# Altium project zxevo.PrjPcb (part 2 of 2)

## Sheet Power ATX.SchDoc
size A4; SheetNumber: 2; SheetTotal: 15
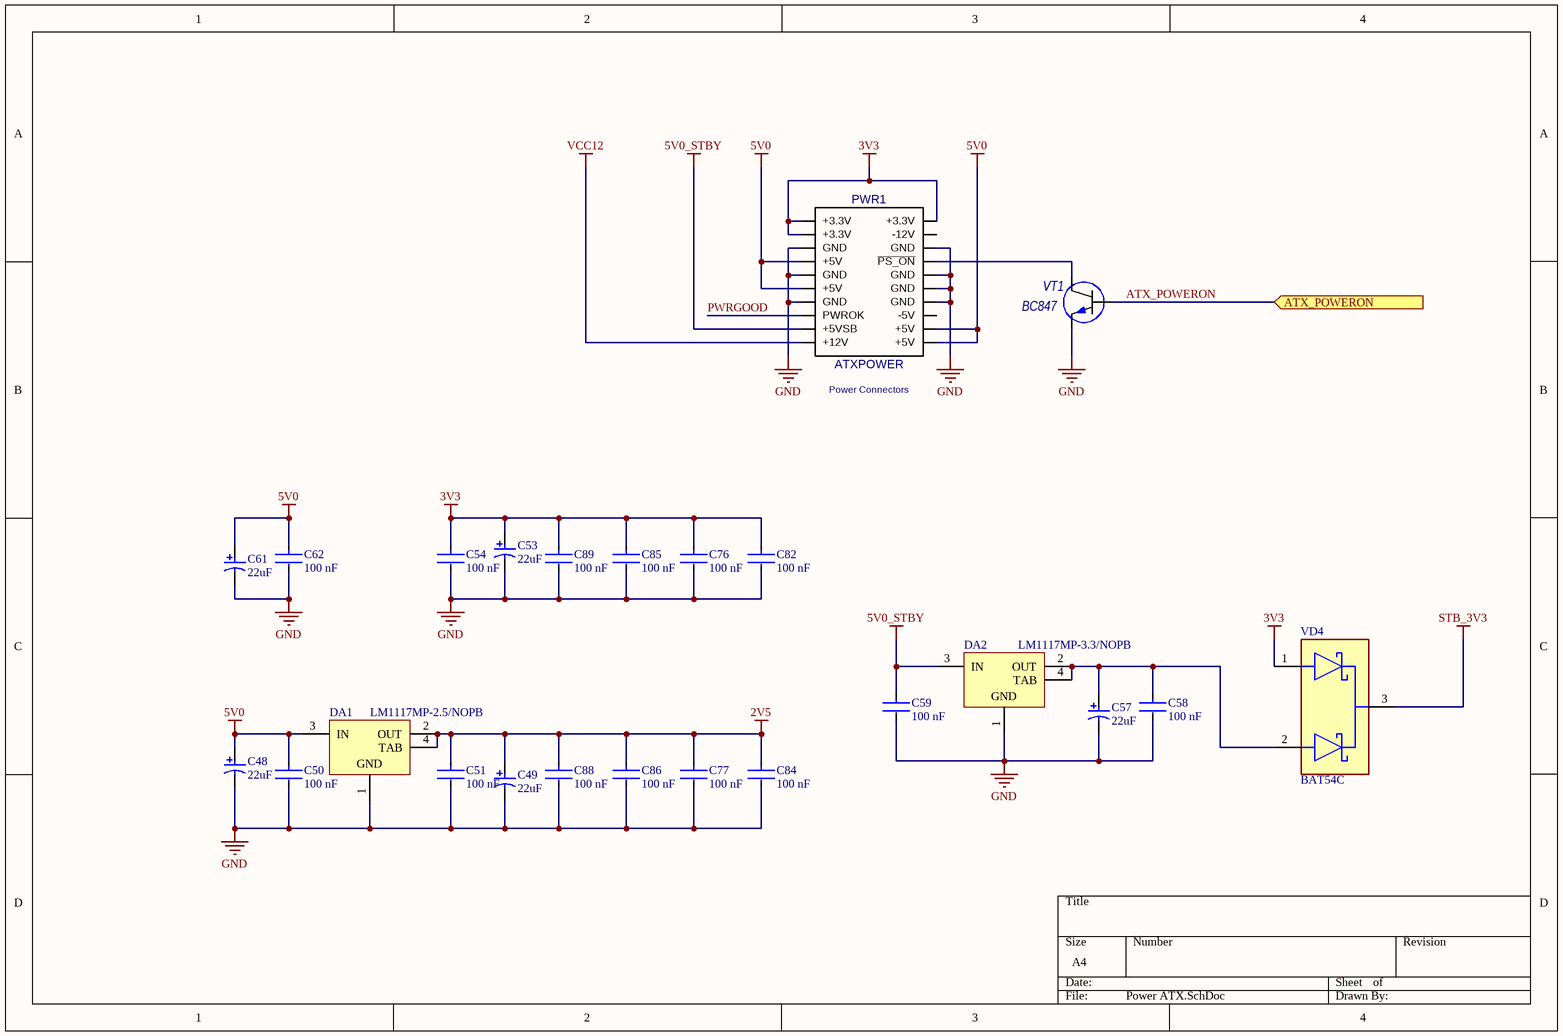
[diagram p9: Power ATX.SchDoc]

### Parts
C48  Capacitance: 22uF  [AVX-TAJ-B-2_M]  (hidden comment: TAJB226K016RNJ)
C49  Capacitance: 22uF  [AVX-TAJ-B-2_M]  (hidden comment: TAJB226K016RNJ)
C50  Capacitance: 100 nF  [FP-CC0805-0_85-IPC_A]  (hidden comment: CC0805KRX7R9BB104)
C51  Capacitance: 100 nF  [FP-CC0805-0_85-IPC_A]  (hidden comment: CC0805KRX7R9BB104)
C53  Capacitance: 22uF  [AVX-TAJ-B-2_M]  (hidden comment: TAJB226K016RNJ)
C54  Capacitance: 100 nF  [FP-CC0805-0_85-IPC_A]  (hidden comment: CC0805KRX7R9BB104)
C57  Capacitance: 22uF  [AVX-TAJ-B-2_M]  (hidden comment: TAJB226K016RNJ)
C58  Capacitance: 100 nF  [FP-CC0805-0_85-IPC_A]  (hidden comment: CC0805KRX7R9BB104)
C59  Capacitance: 100 nF  [FP-CC0805-0_85-IPC_A]  (hidden comment: CC0805KRX7R9BB104)
C61  Capacitance: 22uF  [AVX-TAJ-B-2_M]  (hidden comment: TAJB226K016RNJ)
C62  Capacitance: 100 nF  [FP-CC0805-0_85-IPC_A]  (hidden comment: CC0805KRX7R9BB104)
C76  Capacitance: 100 nF  [FP-CC0805-0_85-IPC_A]  (hidden comment: CC0805KRX7R9BB104)
C77  Capacitance: 100 nF  [FP-CC0805-0_85-IPC_A]  (hidden comment: CC0805KRX7R9BB104)
C82  Capacitance: 100 nF  [FP-CC0805-0_85-IPC_A]  (hidden comment: CC0805KRX7R9BB104)
C84  Capacitance: 100 nF  [FP-CC0805-0_85-IPC_A]  (hidden comment: CC0805KRX7R9BB104)
C85  Capacitance: 100 nF  [FP-CC0805-0_85-IPC_A]  (hidden comment: CC0805KRX7R9BB104)
C86  Capacitance: 100 nF  [FP-CC0805-0_85-IPC_A]  (hidden comment: CC0805KRX7R9BB104)
C88  Capacitance: 100 nF  [FP-CC0805-0_85-IPC_A]  (hidden comment: CC0805KRX7R9BB104)
C89  Capacitance: 100 nF  [FP-CC0805-0_85-IPC_A]  (hidden comment: CC0805KRX7R9BB104)
DA1  LM1117MP-2.5/NOPB  [DCY0004A_M]
DA2  LM1117MP-3.3/NOPB  [DCY0004A_L]
PWR1  ATXPOWER  [ATXPOWER]
VD4  BAT54C  [FP-MA03D-MFG]
VT1  BC847  [SOT-23]

### Ports
ATX_POWERON (in)

### Nets
2V5: C49.1 C51.1 C77.1 C84.1 C86.1 C88.1 DA1.2(OUT) DA1.4(TAB)
3V3: C53.1 C54.1 C76.1 C82.1 C85.1 C89.1 PWR1.1(+3.3V) PWR1.2(+3.3V) PWR1.11(+3.3V) VD4.1(1_ANODE)
5V0: C48.1 C50.1 C61.1 C62.1 DA1.3(IN) PWR1.4(+5V) PWR1.6(+5V) PWR1.19(+5V) PWR1.20(+5V)
5V0_STBY: C59.1 DA2.3(IN) PWR1.9(+5VSB)
GND: C48.2 C49.2 C50.2 C51.2 C53.2 C54.2 C57.2 C58.2 C59.2 C61.2 C62.2 C76.2 C77.2 C82.2 C84.2 C85.2 C86.2 C88.2 C89.2 DA1.1(GND) DA2.1(GND) PWR1.3(GND) PWR1.5(GND) PWR1.7(GND) PWR1.13(GND) PWR1.15(GND) PWR1.16(GND) PWR1.17(GND) VT1.2(emitter)
STB_3V3: VD4.3(COMMON_CATHODE)
VCC12: PWR1.10(+12V)
ATX_POWERON: VT1.1(base) ; port ATX_POWERON
PWRGOOD: PWR1.8(PWROK)  [project net PWRGOOD_2]
NetC57_1: C57.1 C58.1 DA2.2(OUT) DA2.4(TAB) VD4.2(2_ANODE)
NetPWR1_14: PWR1.14(~{PS_ON}) VT1.3(collector)

Not connected (* = marked no-connect by the designer): PWR1 12(-12V) 18(-5V)

### Notes on the sheet
- (near PWR1) Power Connectors

### Library data of the parts
C48 C49 C53 C57 C61 = CMP-2100-03689-1: Standard Tantalum, 22 uF, +/- 10%, 16 V, -55 to 125 degC, 2-Pin SMD (1210), RoHS, Tape and Reel; Manufacturer: Kyocera AVX; value: 22uF; Number of Pins: 2; Termination: SMD/SMT; Case/Package: 1210; Manufacturer Part Number: TAJB226K016RNJ; Category: Cap
C50 C51 C54 C58 C59 C62 C76 C77 C82 C84-C86 C88 C89 = CMP-2100-03606-3: as C106 on sheet FPGA; Manufacturer Part Number: CC0805KRX7R9BB104; Category: Cap; Case/Package: 0805
DA1 = CMP-0062-01660-4: 800mA Low-Dropout Linear Regulator, 4-pin SOT-223, Pb-Free; Manufacturer: TI National Semiconductor; PartNumber: LM1117MP-2.5/NOPB; PackageDescription: Molded SOT-223, 6.50 x 3.56 x 1.6mm Body, 4 Lead, 2.3mm Pitch; Manufacturer Part Number: LM1117MP-2.5/NOPB; value: LM1117MP-2.5/NOPB; Case/Package: SOT-223; Category: IC
DA2 = CMP-0062-01638-4: 800mA Low-Dropout Linear Regulator, 4-pin SOT-223, Pb-Free; Manufacturer: TI National Semiconductor; PackageDescription: Molded SOT-223, 6.50 x 3.56 x 1.6mm Body, 4 Lead, 2.3mm Pitch; PartNumber: LM1117MP-3.3/NOPB; Manufacturer Part Number: LM1117MP-3.3/NOPB; value: LM1117MP-3.3/NOPB; Case/Package: SOT-223; Category: IC
PWR1 = ATXPOWER: Analogs: MF-20MA;N42GP-20; Value: ATXPOWER; Case/Package: Mini-Fit 20 PIN 5.2; Category: Connector
VD4 = CMP-07162-000010-1: DIODE ARRAY SCHOTTKY 30V SOT23-3; Manufacturer: ON Semiconductor / Fairchild; Capacitance: 10pF; Category: Diode; Manufacturer Part Number: BAT54C; Value: BAT54C; Case/Package: SOT-23
VT1 = BC847: Value: BC847; Case/Package: SOT-23; Category: Transistor

## Sheet USB.SchDoc
size A4; SheetNumber: 7; SheetTotal: 15
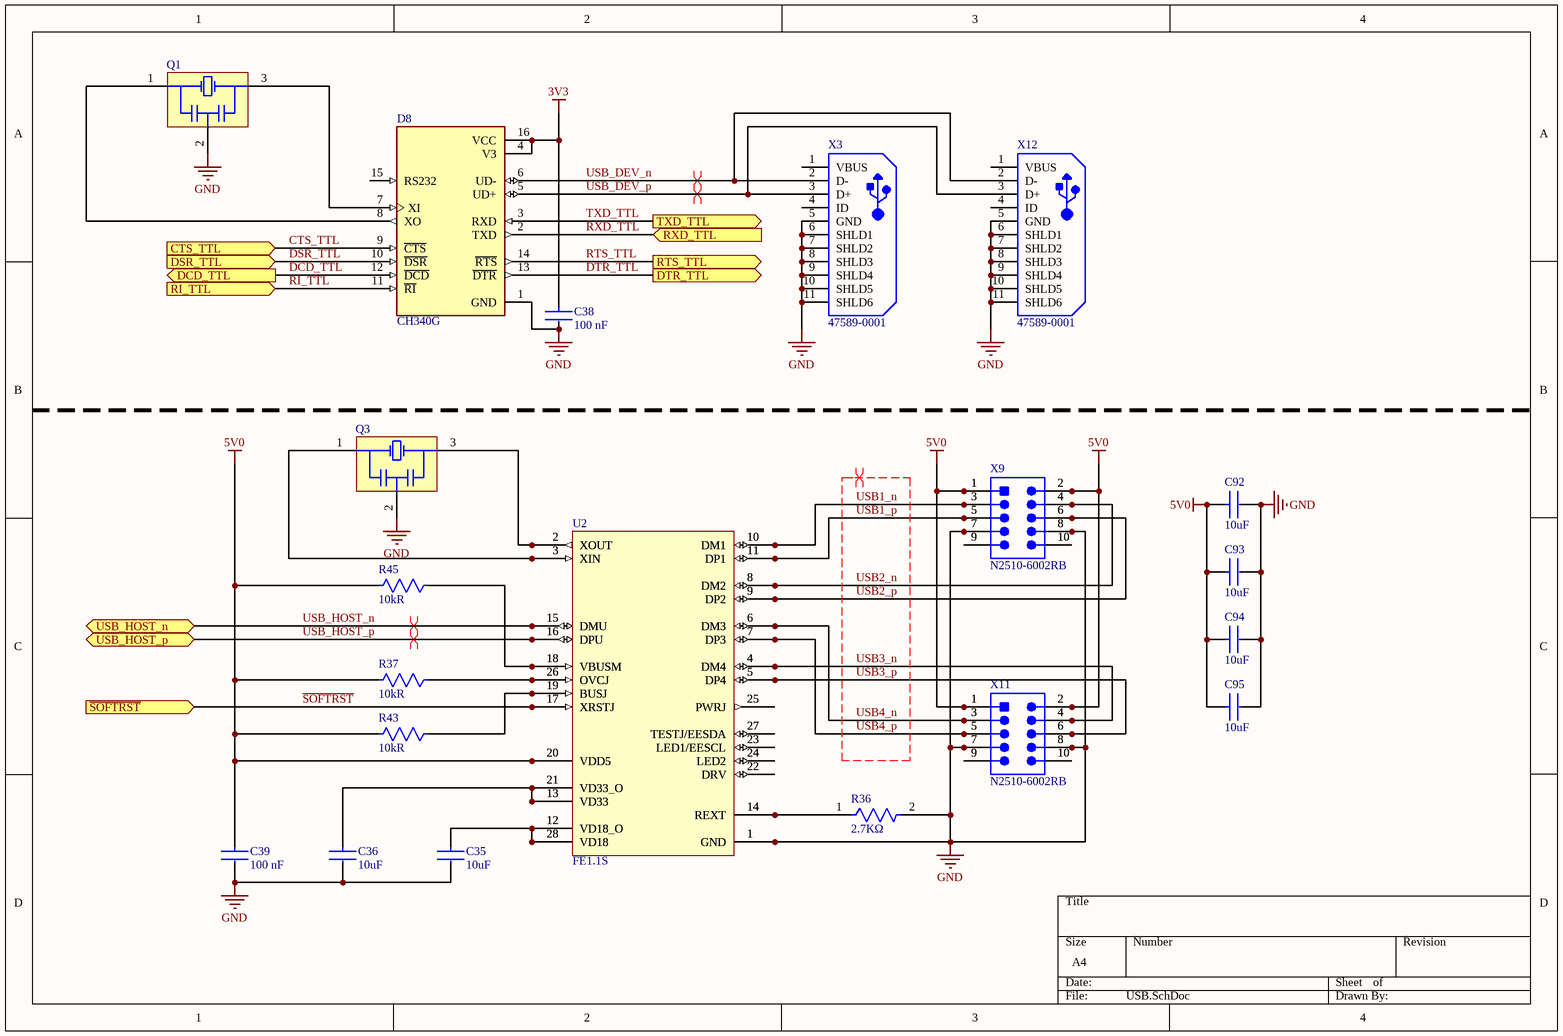
[diagram p10: USB.SchDoc]

### Parts
C35  Capacitance: 10uF  [FP-C0805C-DG-IPC_A]  (hidden comment: C0805C106K8PACTU)
C36  Capacitance: 10uF  [FP-C0805C-DG-IPC_A]  (hidden comment: C0805C106K8PACTU)
C38  Capacitance: 100 nF  [FP-CC0805-0_85-IPC_A]  (hidden comment: CC0805KRX7R9BB104)
C39  Capacitance: 100 nF  [FP-CC0805-0_85-IPC_A]  (hidden comment: CC0805KRX7R9BB104)
C92  Capacitance: 10uF  [FP-C0805C-DG-IPC_A]  (hidden comment: C0805C106K8PACTU)
C93  Capacitance: 10uF  [FP-C0805C-DG-IPC_A]  (hidden comment: C0805C106K8PACTU)
C94  Capacitance: 10uF  [FP-C0805C-DG-IPC_A]  (hidden comment: C0805C106K8PACTU)
C95  Capacitance: 10uF  [FP-C0805C-DG-IPC_A]  (hidden comment: C0805C106K8PACTU)
D8  CH340G  [SOIC127P600X180-16N]
Q1  CSTCE12M0G55Z-R0  [MURA-CSTCE_G_V]  (value not drawn)
Q3  CSTCE12M0G55Z-R0  [MURA-CSTCE_G_V]  (value not drawn)
R36  Resistance: 2.7KΩ  [FP-AC0805-IPC_A]  (hidden comment: AC0805FR-072K7L)
R37  Resistance: 10kR  [FP-CR0805-IPC_A]  (hidden comment: CR0805-JW-103ELF)
R43  Resistance: 10kR  [FP-CR0805-IPC_A]  (hidden comment: CR0805-JW-103ELF)
R45  Resistance: 10kR  [FP-CR0805-IPC_A]  (hidden comment: CR0805-JW-103ELF)
U2  FE1.1S  [TSOP64P600X160-28L]
X3  47589-0001  [MOLX-47589-0001_V]
X9  N2510-6002RB  [3M-N2510-6002-10_V]
X11  N2510-6002RB  [3M-N2510-6002-10_V]
X12  47589-0001  [MOLX-47589-0001_V]

### Ports
CTS_TTL (in), DCD_TTL (out), DSR_TTL (in), DTR_TTL (out), RI_TTL (in), RTS_TTL (out), RXD_TTL (in), TXD_TTL (out), USB_HOST_n (bidir), USB_HOST_p (bidir), ~{SOFTRST} (in)

### Nets
3V3: C38.1 D8.4(V3) D8.16(VCC)
5V0: C39.1 C92.1 C93.1 C94.1 C95.1 R37.2 R43.2 R45.2 U2.20(VDD5) X9.1 X9.2 X11.1 X11.2
GND: C35.2 C36.2 C38.2 C39.2 C92.2 C93.2 C94.2 C95.2 D8.1(GND) Q1.2(GND) Q3.2(GND) R36.2 U2.1(GND) X3.5(GND) X3.6(SHLD1) X3.7(SHLD2) X3.8(SHLD3) X3.9(SHLD4) X3.10(SHLD5) X3.11(SHLD6) X9.7 X9.8 X11.7 X11.8 X12.5(GND) X12.6(SHLD1) X12.7(SHLD2) X12.8(SHLD3) X12.9(SHLD4) X12.10(SHLD5) X12.11(SHLD6)
CTS_TTL: D8.9(~{CTS}) ; port CTS_TTL
DCD_TTL: D8.12(~{DCD}) ; port DCD_TTL
DSR_TTL: D8.10(~{DSR}) ; port DSR_TTL
DTR_TTL: D8.13(~{DTR}) ; port DTR_TTL  [project net DTR]
RI_TTL: D8.11(~{RI}) ; port RI_TTL
RTS_TTL: D8.14(~{RTS}) ; port RTS_TTL  [project net RTS]
RXD_TTL: D8.2(TXD) ; port RXD_TTL  [project net ESP32_TXD]
~{SOFTRST}: U2.17(XRSTJ) ; port ~{SOFTRST}
TXD_TTL: D8.3(RXD) ; port TXD_TTL  [project net ESP32_RXD]
USB1_n: U2.10(DM1) X9.3  [project net USB1_n_7]
USB1_p: U2.11(DP1) X9.5  [project net USB1_p_7]
USB2_n: U2.8(DM2) X9.4  [project net USB2_n_7]
USB2_p: U2.9(DP2) X9.6  [project net USB2_p_7]
USB3_n: U2.4(DM4) X11.4  [project net USB3_n_7]
USB3_p: U2.5(DP4) X11.6  [project net USB3_p_7]
USB4_n: U2.6(DM3) X11.3  [project net USB4_n_7]
USB4_p: U2.7(DP3) X11.5  [project net USB4_p_7]
USB_DEV_n: D8.6(UD-) X3.2(D-) X12.2(D-)  [project net USB_DEV_n_7]
USB_DEV_p: D8.5(UD+) X3.3(D+) X12.3(D+)  [project net USB_DEV_p_7]
USB_HOST_n: U2.15(DMU) ; port USB_HOST_n  [project net USB_n]
USB_HOST_p: U2.16(DPU) ; port USB_HOST_p  [project net USB_p]
NetC35_1: C35.1 U2.12(VD18_O) U2.28(VD18)
NetC36_1: C36.1 U2.13(VD33) U2.21(VD33_O)
NetD8_7: D8.7(XI) Q1.3(X2)
NetD8_8: D8.8(XO) Q1.1(X1)
NetQ3_1: Q3.1(X1) U2.3(XIN)
NetQ3_3: Q3.3(X2) U2.2(XOUT)
NetR36_1: R36.1 U2.14(REXT)
NetR37_1: R37.1 U2.26(OVCJ)
NetR43_1: R43.1 U2.19(BUSJ)
NetR45_1: R45.1 U2.18(VBUSM)

Not connected (* = marked no-connect by the designer): D8 15(RS232); U2 22(DRV) 23(LED1/EESCL) 24(LED2) 25(PWRJ) 27(TESTJ/EESDA); X3 1(VBUS) 4(ID); X9 9 10; X11 9 10; X12 1(VBUS) 4(ID)

### Layout directives
differential pair: USB1_n, USB1_p, USB2_n, USB2_p, USB3_n, USB3_p, USB4_n, USB4_p, USB_DEV_n_7, USB_DEV_p_7, USB_n, USB_p

### Library data of the parts
C35 C36 C92-C95 = CMP-2007-03243-2: CAP CER 10UF 10V X5R 0805; Manufacturer: KEMET; Manufacturer Part Number: C0805C106K8PACTU; Value: 10uF; Category: Cap; Case/Package: 0805
C38 C39 = CMP-2100-03606-3: as C106 on sheet FPGA; Category: Cap; Manufacturer Part Number: CC0805KRX7R9BB104; Case/Package: 0805
D8 = CH340G: USB Interface Integrated Circuit; Value: CH340G; Case/Package: SOIC-16; Category: IC
Q1 Q3 = CMP-2000-06123-1: Ceramic Resonator, 12 MHz, +/- 0.5%, -40 to 125 degC, 3-Pin SMD, RoHS, Tape and Reel; Manufacturer: Murata; Capacitance: 33pF; Category: CrystalsandOscillators; Manufacturer Part Number: CSTCE12M0G55Z-R0; value: CSTCE12M0G55Z-R0
R36 = CMP-2001-04496-2: RES SMD 2.7K OHM 1% 1/8W 0805; Manufacturer: Yageo; Value: 2.7KΩ; Manufacturer Part Number: AC0805FR-072K7L; Category: Res; Case/Package: 0805
R37 R43 R45 = CMP-07231-003873-1: as R20 on sheet FPGA; Number of Terminations: 2; Termination: SMD/SMT; Number of Pins: 2; Case/Package: 0805; Manufacturer Part Number: CR0805-JW-103ELF; value: 10kΩ; Category: Res
U2 = FE1.1S: USB 2.0 HIGH SPEED 4-PORT HUB CONTROLLER; Manufacturer: Terminus Technology Inc; value: FE1.1S; Case/Package: SSOP-28; Category: IC
X3 X12 = CMP-2000-05610-1: Right Angle Female Type AB Micro USB Connector, 30 V, 1.8 A, -30 to 85 degC, RoHS, Tape and Reel; Manufacturer: Molex; Manufacturer Part Number: 47589-0001; value: 47589-0001; Case/Package: Micro USB  (molex 47589-0001); Category: Connector
X9 X11 = CMP-2000-06794-1: as X15 on sheet FPGA; Manufacturer Part Number: N2510-6002RB; Case/Package: IDC-10; Category: Connector

## Sheet ESP32.SchDoc
size A3; SheetNumber: 11; SheetTotal: 15
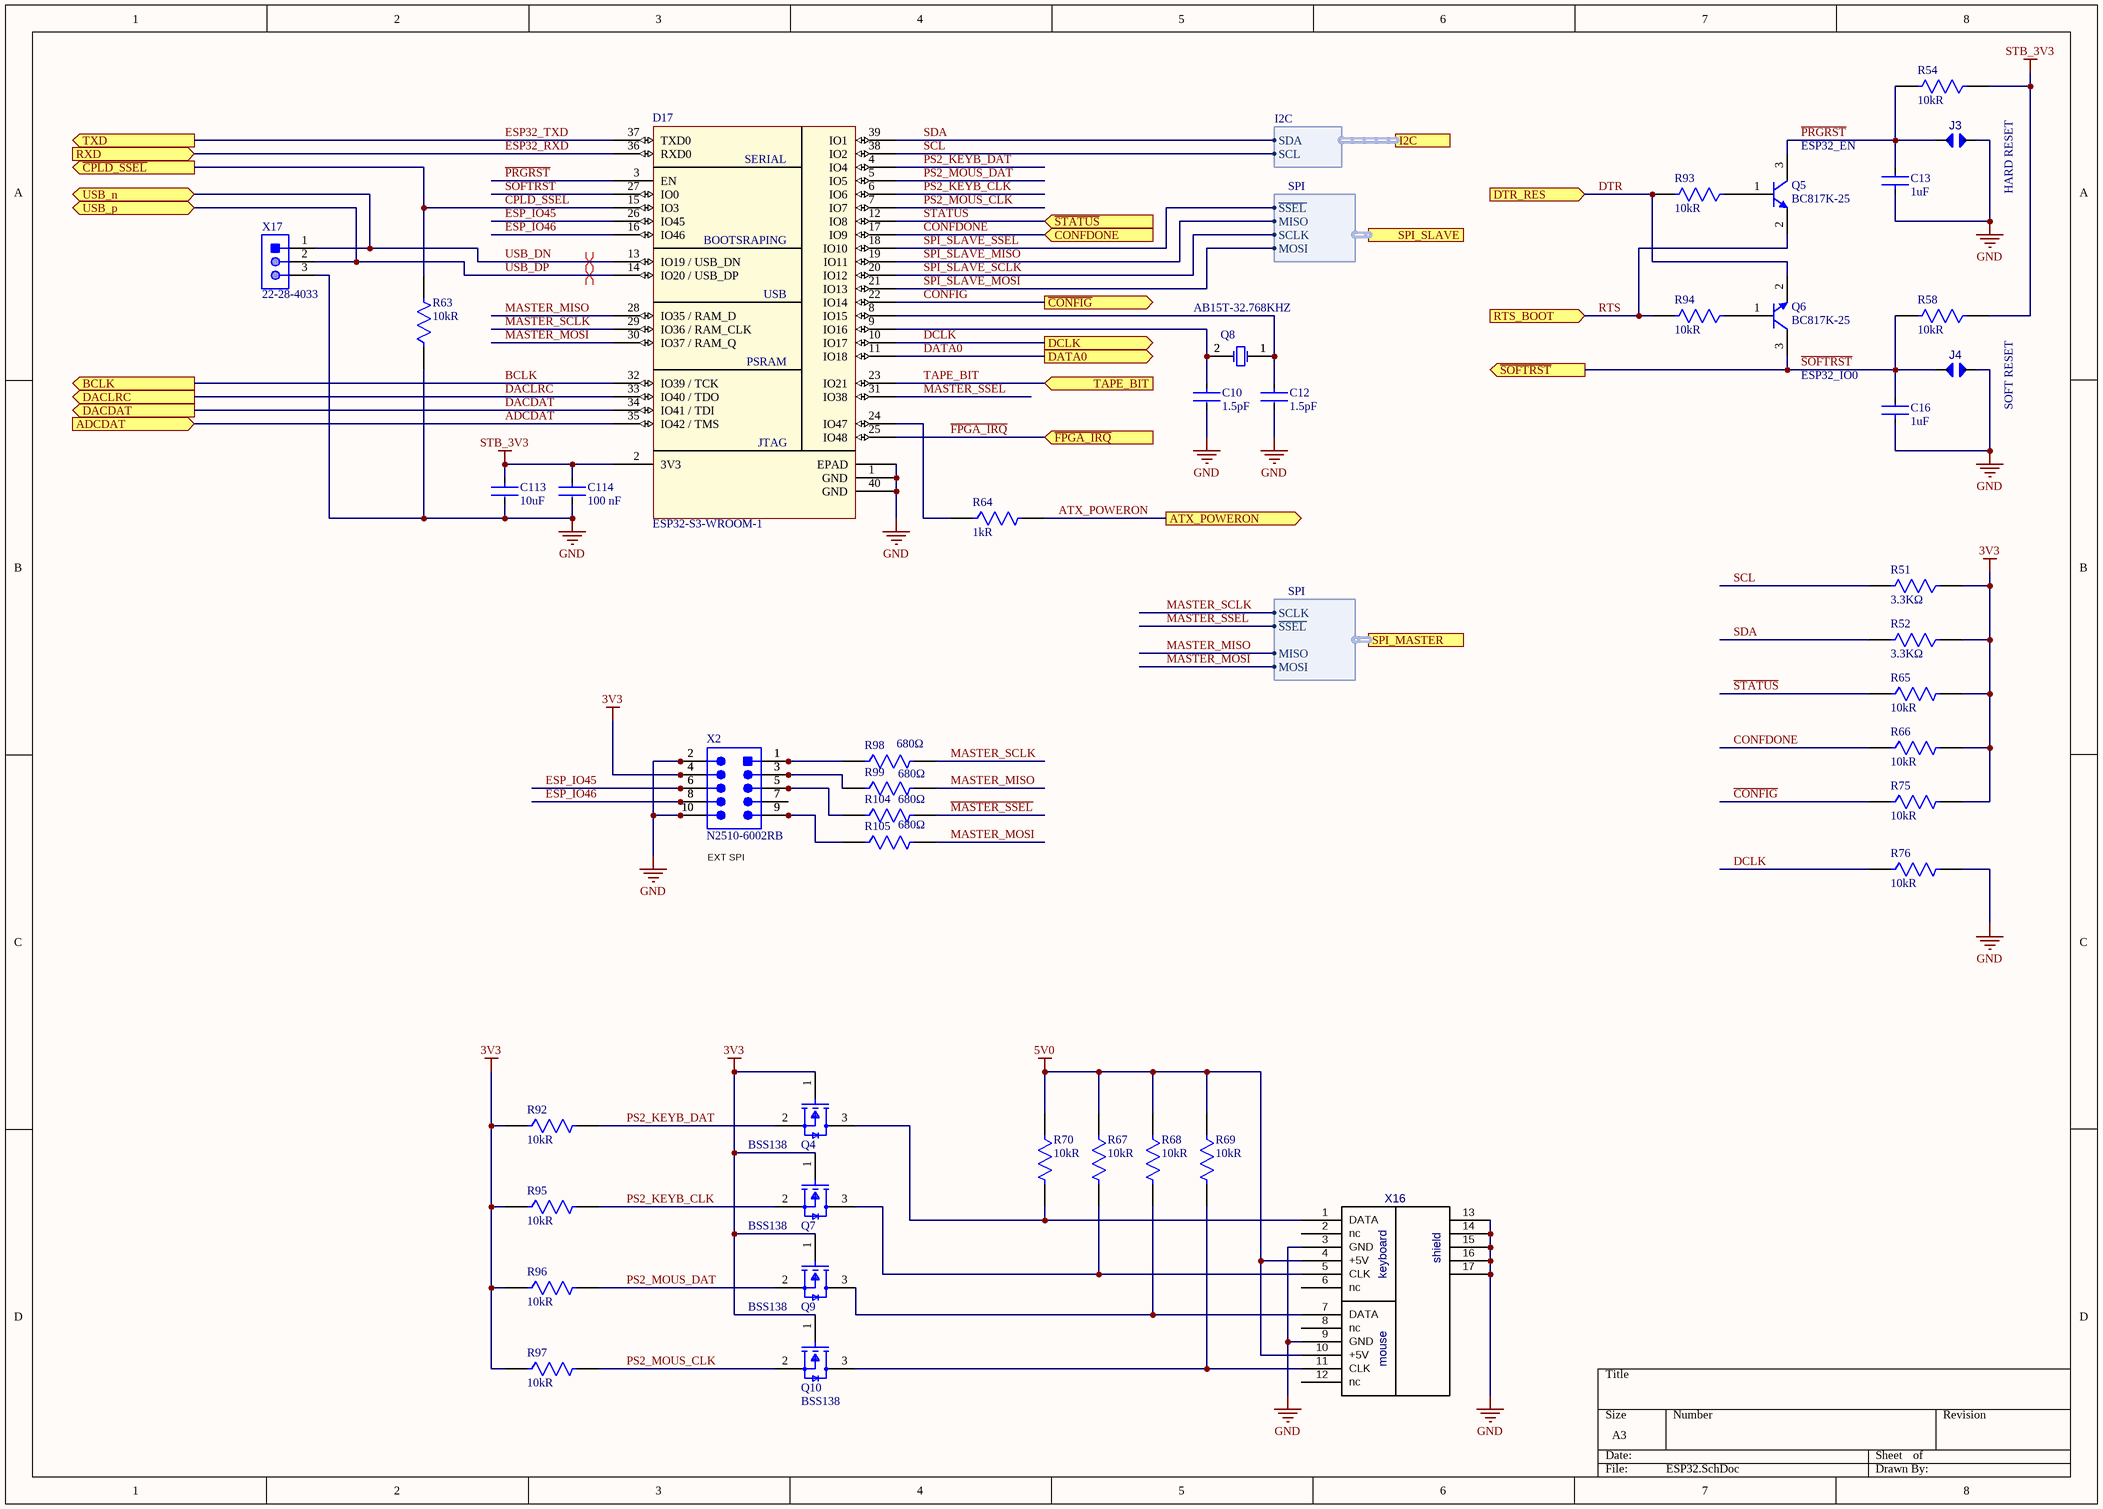
[diagram p11: ESP32.SchDoc]

### Parts
C10  Capacitance: 1.5pF  [FP-CL21-IPC_A]  (hidden comment: CL21C1R5CBANNNC)
C12  Capacitance: 1.5pF  [FP-CL21-IPC_A]  (hidden comment: CL21C1R5CBANNNC)
C13  Capacitance: 1uF  [FP-GCM21B-0_15-IPC_A]  (hidden comment: GCM21BR71E105KA56L)
C16  Capacitance: 1uF  [FP-GCM21B-0_15-IPC_A]  (hidden comment: GCM21BR71E105KA56L)
C113  Capacitance: 10uF  [FP-C0805C-DG-IPC_A]  (hidden comment: C0805C106K8PACTU)
C114  Capacitance: 100 nF  [FP-CC0805-0_85-IPC_A]  (hidden comment: CC0805KRX7R9BB104)
D17  ESP32-S3-WROOM-1  [ESP32S3WROOM1]
J3  JUMPER  [JUMPER_JUMPER(Primary)]  (value not drawn)
J4  JUMPER  [JUMPER_JUMPER(Primary)]  (value not drawn)
Q4  BSS138  [FP-318-08-IPC_B]
Q5  BC817K-25  [INF-SOT23_N]
Q6  BC817K-25  [INF-SOT23_N]
Q7  BSS138  [FP-318-08-IPC_B]
Q8  AB15T-32.768KHZ  [ABRA-AB15T-2_V]
Q9  BSS138  [FP-318-08-IPC_B]
Q10  BSS138  [FP-318-08-IPC_B]
R51  Resistance: 3.3KΩ  [FP-RT0805-IPC_A]  (hidden comment: RT0805FRE073K3L)
R52  Resistance: 3.3KΩ  [FP-RT0805-IPC_A]  (hidden comment: RT0805FRE073K3L)
R54  Resistance: 10kR  [FP-CR0805-IPC_A]  (hidden comment: CR0805-JW-103ELF)
R58  Resistance: 10kR  [FP-CR0805-IPC_A]  (hidden comment: CR0805-JW-103ELF)
R63  Resistance: 10kR  [FP-CR0805-IPC_A]  (hidden comment: CR0805-JW-103ELF)
R64  Resistance: 1kR  [FP-MCR10-IPC_A]  (hidden comment: MCR10ERTJ102)
R65  Resistance: 10kR  [FP-CR0805-IPC_A]  (hidden comment: CR0805-JW-103ELF)
R66  Resistance: 10kR  [FP-CR0805-IPC_A]  (hidden comment: CR0805-JW-103ELF)
R67  Resistance: 10kR  [FP-CR0805-IPC_A]  (hidden comment: CR0805-JW-103ELF)
R68  Resistance: 10kR  [FP-CR0805-IPC_A]  (hidden comment: CR0805-JW-103ELF)
R69  Resistance: 10kR  [FP-CR0805-IPC_A]  (hidden comment: CR0805-JW-103ELF)
R70  Resistance: 10kR  [FP-CR0805-IPC_A]  (hidden comment: CR0805-JW-103ELF)
R75  Resistance: 10kR  [FP-CR0805-IPC_A]  (hidden comment: CR0805-JW-103ELF)
R76  Resistance: 10kR  [FP-CR0805-IPC_A]  (hidden comment: CR0805-JW-103ELF)
R92  Resistance: 10kR  [FP-CR0805-IPC_A]  (hidden comment: CR0805-JW-103ELF)
R93  Resistance: 10kR  [FP-CR0805-IPC_A]  (hidden comment: CR0805-JW-103ELF)
R94  Resistance: 10kR  [FP-CR0805-IPC_A]  (hidden comment: CR0805-JW-103ELF)
R95  Resistance: 10kR  [FP-CR0805-IPC_A]  (hidden comment: CR0805-JW-103ELF)
R96  Resistance: 10kR  [FP-CR0805-IPC_A]  (hidden comment: CR0805-JW-103ELF)
R97  Resistance: 10kR  [FP-CR0805-IPC_A]  (hidden comment: CR0805-JW-103ELF)
R98  value 680Ω  [FP-RT0805-IPC_A]  (hidden comment: RT0805FRE07680RL)
R99  value 680Ω  [FP-RT0805-IPC_A]  (hidden comment: RT0805FRE07680RL)
R104  value 680Ω  [FP-RT0805-IPC_A]  (hidden comment: RT0805FRE07680RL)
R105  value 680Ω  [FP-RT0805-IPC_A]  (hidden comment: RT0805FRE07680RL)
X2  N2510-6002RB  [3M-N2510-6002-10_V]
X16  KEYB-MOUSE  [MDD-6FR]  (value not drawn)
X17  22-28-4033  [MOLX-22-28-4033_V]

### Ports
ADCDAT (in), ATX_POWERON (out), BCLK (out), CONFDONE (in), DACDAT (out), DACLRC (out), DATA0 (out), DCLK (out), DTR_RES (in), I2C (harness I2C), RTS_BOOT (in), RXD (in), SPI_MASTER (harness SPI), SPI_SLAVE (harness SPI), TAPE_BIT (in), TXD (out), USB_n (bidir), USB_p (bidir), ~{CONFIG} (out), ~{CPLD_SSEL} (out), ~{FPGA_IRQ} (in), ~{SOFTRST} (out), ~{STATUS} (in)

### Harnesses
SPI: ~{SSEL}, SCLK, MOSI, MISO
I2C: SDA, SCL

### Nets
3V3: Q4.1(G) Q7.1(G) Q9.1(G) Q10.1(G) R51.1 R52.1 R65.2 R66.2 R75.2 R92.1 R95.1 R96.1 R97.1 X2.4
5V0: R67.1 R68.1 R69.1 R70.1 X16.4(+5V) X16.10(+5V)
GND: C10.2 C12.2 C13.1 C16.1 C113.2 C114.2 D17.1(GND) D17.40(GND) D17.EPAD J3.1 J4.1 R63.1 R76.2 X2.2 X2.10 X16.3(GND) X16.9(GND) X16.13(shield) X16.14(shield) X16.15(shield) X16.16(shield) X16.17(shield) X17.3
STB_3V3: C113.1 C114.1 D17.2(3V3) R54.1 R58.1
ADCDAT: D17.35(IO42_/_TMS) ; port ADCDAT
ATX_POWERON: R64.2 ; port ATX_POWERON
BCLK: D17.32(IO39_/_TCK) ; port BCLK
~{CONFIG}: D17.22(IO14) R75.1 ; port ~{CONFIG}
~{CPLD_SSEL}: D17.15(IO3) R63.2 ; port ~{CPLD_SSEL}
CONFDONE: D17.17(IO9) R66.1 ; port CONFDONE
DACDAT: D17.34(IO41_/_TDI) ; port DACDAT
DACLRC: D17.33(IO40_/_TDO) ; port DACLRC
DATA0: D17.11(IO18) ; port DATA0
DCLK: D17.10(IO17) R76.1 ; port DCLK
DTR: Q6.2(E) R93.2 ; port DTR_RES
ESP32_RXD: D17.36(RXD0) ; port RXD
ESP32_TXD: D17.37(TXD0) ; port TXD
ESP_IO45: D17.26(IO45) X2.6  [project net ESP_IO45_11]
ESP_IO46: D17.16(IO46) X2.8  [project net ESP_IO46_11]
~{FPGA_IRQ}: D17.25(IO48) ; port ~{FPGA_IRQ}  [project net ~{SPI_SLAVE_IRQ}]
~{MASTER_SSEL}: D17.31(IO38) R104.2 ; port SPI_MASTER.~{SSEL}  [project net ESP32_MASTER.~{SSEL}]
MASTER_MISO: D17.28(IO35_/_RAM_D) R99.2 ; port SPI_MASTER.MISO  [project net ESP32_MASTER.MISO]
MASTER_MOSI: D17.30(IO37_/_RAM_Q) R105.2 ; port SPI_MASTER.MOSI  [project net ESP32_MASTER.MOSI]
MASTER_SCLK: D17.29(IO36_/_RAM_CLK) R98.2 ; port SPI_MASTER.SCLK  [project net ESP32_MASTER.SCLK]
~{PRGRST}: C13.2 D17.3(EN) J3.0 Q5.3(C) R54.2  [project net ~{PRGRST}_11]
PS2_KEYB_CLK: D17.6(IO6) Q7.2(S) R95.2  [project net PS2_KEYB_CLK_11]
PS2_KEYB_DAT: D17.4(IO4) Q4.2(S) R92.2  [project net PS2_KEYB_DAT_11]
PS2_MOUS_CLK: D17.7(IO7) Q10.2(S) R97.2  [project net PS2_MOUS_CLK_11]
PS2_MOUS_DAT: D17.5(IO5) Q9.2(S) R96.2  [project net PS2_MOUS_DAT_11]
RTS: Q5.2(E) R94.2 ; port RTS_BOOT
~{SOFTRST}: C16.2 D17.27(IO0) J4.0 Q6.3(C) R58.2 ; port ~{SOFTRST}
~{SPI_SLAVE_SSEL}: D17.18(IO10) ; port SPI_SLAVE.~{SSEL}  [project net ESP32_SLAVE.~{SSEL}]
~{STATUS}: D17.12(IO8) R65.1 ; port ~{STATUS}
SCL: D17.38(IO2) R51.2 ; port I2C.SCL  [project net I2C.SCL]
SDA: D17.39(IO1) R52.2 ; port I2C.SDA  [project net I2C.SDA]
SPI_SLAVE_MISO: D17.19(IO11) ; port SPI_SLAVE.MISO  [project net ESP32_SLAVE.MISO]
SPI_SLAVE_MOSI: D17.21(IO13) ; port SPI_SLAVE.MOSI  [project net ESP32_SLAVE.MOSI]
SPI_SLAVE_SCLK: D17.20(IO12) ; port SPI_SLAVE.SCLK  [project net ESP32_SLAVE.SCLK]
TAPE_BIT: D17.23(IO21) ; port TAPE_BIT
USB_DN: D17.13(IO19_/_USB_DN) X17.1 ; port USB_n  [project net USB_n]
USB_DP: D17.14(IO20_/_USB_DP) X17.2 ; port USB_p  [project net USB_p]
NetC10_1: C10.1 D17.9(IO16) Q8.2(X2)
NetC12_1: C12.1 D17.8(IO15) Q8.1(X1)
NetD17_24: D17.24(IO47) R64.1
NetQ4_3: Q4.3(D) R70.2 X16.1(DATA)
NetQ5_1: Q5.1(B) R93.1
NetQ6_1: Q6.1(B) R94.1
NetQ7_3: Q7.3(D) R67.2 X16.5(CLK)
NetQ9_3: Q9.3(D) R68.2 X16.7(DATA)
NetQ10_3: Q10.3(D) R69.2 X16.11(CLK)
NetR98_1: R98.1 X2.1
NetR99_1: R99.1 X2.3
NetR104_1: R104.1 X2.5
NetR105_1: R105.1 X2.9

Not connected (* = marked no-connect by the designer): X2 7; X16 2(nc) 6(nc) 8(nc) 12(nc)

### Layout directives
differential pair: USB_n, USB_p

### Notes on the sheet
- (near Q5) ESP32_EN
- HARD RESET
- ESP32_IO0
- SOFT RESET
- (near X2) EXT SPI
- (in symbol ESP32-S3-WROOM-1) SERIAL; BOOTSRAPING; USB; PSRAM; JTAG
- (in symbol KEYB-MOUSE) keyboard; mouse

### Library data of the parts
C10 C12 = CMP-13271-001925-1: CL21 Series 0805 1.5pF 50V ±0.25pF Tolerance C0G Multilayer Ceramic Chip Capacitor; Manufacturer: Samsung; Case/Package: 0805; Manufacturer Part Number: CL21C1R5CBANNNC; value: 1.5pF; Category: Cap
C13 C16 = CMP-2007-03346-2: Ceramic Capacitor for Automotive 1uF ±10% 25VDC X7R 0805 Embossed T/R; Manufacturer: Murata; Termination: SMD/SMT; Case/Package: 0805; Manufacturer Part Number: GCM21BR71E105KA56L; value: 1uF; Category: Cap
C113 = CMP-2007-03243-2: CAP CER 10UF 10V X5R 0805; Manufacturer: KEMET; Manufacturer Part Number: C0805C106K8PACTU; Value: 10uF; Category: Cap; Case/Package: 0805
C114 = CMP-2100-03606-3: CAP CER 0.1UF 50V X7R 0805; Manufacturer: Yageo; Value: 100 nF; Category: Cap; Manufacturer Part Number: CC0805KRX7R9BB104; Case/Package: 0805
D17 = ESP32-S3-WROOM-1: 2.4 GHz Wi­Fi (802.11 b/g/n) and Bluetooth® 5 (LE) module / Built around ESP32­S3 series of SoCs, Xtensa® dual­core 32­bit LX7 microprocessor / Flash up to 16 MB, PSRAM up to 8 MB / 36 GPIOs, rich set of peripherals / Onboard PCB antenna or external antenna connector; value: ESP32-S3-WROOM-1; Case/Package: ESP32-S3; Category: IC
J3 J4 = JUMPER: HLT->~IP; Value: PLS-2; Case/Package: PLS-2; Category: Connector
Q4 Q7 Q9 Q10 = CMP-07173-000101-1: MOSFET N-CH 50V 220MA SOT-23; Manufacturer: ON Semiconductor / Fairchild; Number of Pins: 3; Case/Package: SOT-23; Termination: SMD/SMT; Manufacturer Part Number: BSS138; value: BSS138; Category: Transistor
Q5 Q6 = CMP-1177-00027-1: NPN Silicon AF Transistor, 45 V VCEO, 500 mA IC, SOT23, Reel, Green; Manufacturer: Infineon; PackageDescription: 3-Pin Small Outline Transistor Package, 1.3 x 2.9 mm Body, 0.95 mm Pitch; PartNumber: BC817K-25; Manufacturer Part Number: BC817K-25; value: BC817K-25; Case/Package: SOT-23; Category: Transistor
Q8 = CMP-1326-00001-1: Low Frequency Cylindrical Watch Crystal, 32.768 kHz, -20 to 70 degC, 2-Pin 5 x 1.4 x 1.5 mm THD, RoHS, Bulk; Manufacturer: Abracon; PackageDescription: 2-Pin THD, Body 5 x 1.4 mm, Pin Spacing 0.45 mm; PartNumber: AB15T-32.768KHZ; Manufacturer Part Number: AB15T-32.768KHZ; value: AB15T-32.768KHZ; Category: CrystalsandOscillators
R51 R52 = CMP-03412-025935-1: RES SMD 3.3K OHM 1% 1/8W 0805; Manufacturer: Yageo; Value: 3.3KΩ; Manufacturer Part Number: RT0805FRE073K3L; Category: Res; Case/Package: 0805
R54 R58 R63 R65-R70 R75 R76 R92-R97 = CMP-07231-003873-1: Thick Film Chip Resistors 0805 10kΩ 0.125W 5% 200ppm/°C; Manufacturer: Bourns; value: 10kΩ; Manufacturer Part Number: CR0805-JW-103ELF; Number of Terminations: 2; Termination: SMD/SMT; Number of Pins: 2; Case/Package: 0805; Category: Res
R64 = CMP-08839-004390-1: Thick Film Chip Resistor, 0805, 1kΩ, 5%, 200ppm/°C, 0.125W, 150V; Manufacturer: Rohm; Case/Package: 0805; Number of Terminations: 2; Manufacturer Part Number: MCR10ERTJ102; value: 1kΩ; Category: Res
R98 R99 R104 R105 = CMP-03412-000082-1: RES SMD 680 OHM 1% 1/8W 0805; Manufacturer: Yageo; Category: Res; Manufacturer Part Number: RT0805FRE07680RL; Resistance: 680Ω; Case/Package: 0805
X2 = CMP-2000-06794-1: Male Header, Pitch 2.54 mm, 2 x 5 Postion, Height 9.91 mm, Tail Length 2.84 mm, -55 to 105 degC, RoHS, Bulk; PartNumber: N2510; Manufacturer: 3M; Pitch: 2.54mm; value: 10-Pin Shrouded Header, 2.54mm; Manufacturer Part Number: N2510-6002RB; Case/Package: IDC-10; Category: Connector
X17 = CMP-1676-00001-5: Male Header, Pitch 2.54 mm, 1 x 3 Position, Height 8.38 mm, Tail Length 3.18 mm, RoHS, Bulk; Manufacturer: Molex; value: header 3 pin, 2.54mm; PackageDescription: Male Header, Pitch 2.54 mm, 1 x 3 Position, Height 8.38 mm, Tail Length 3.18 mm; Manufacturer Part Number: 22-28-4033; Case/Package: PLS-3; Category: Connector
X16 = KEYB-MOUSE: Value: KEYB-MOUSE; Case/Package: Stacked Mini DIN; Category: Connector

## Sheet AY Amp.SchDoc
size A3; SheetNumber: 3; SheetTotal: 15
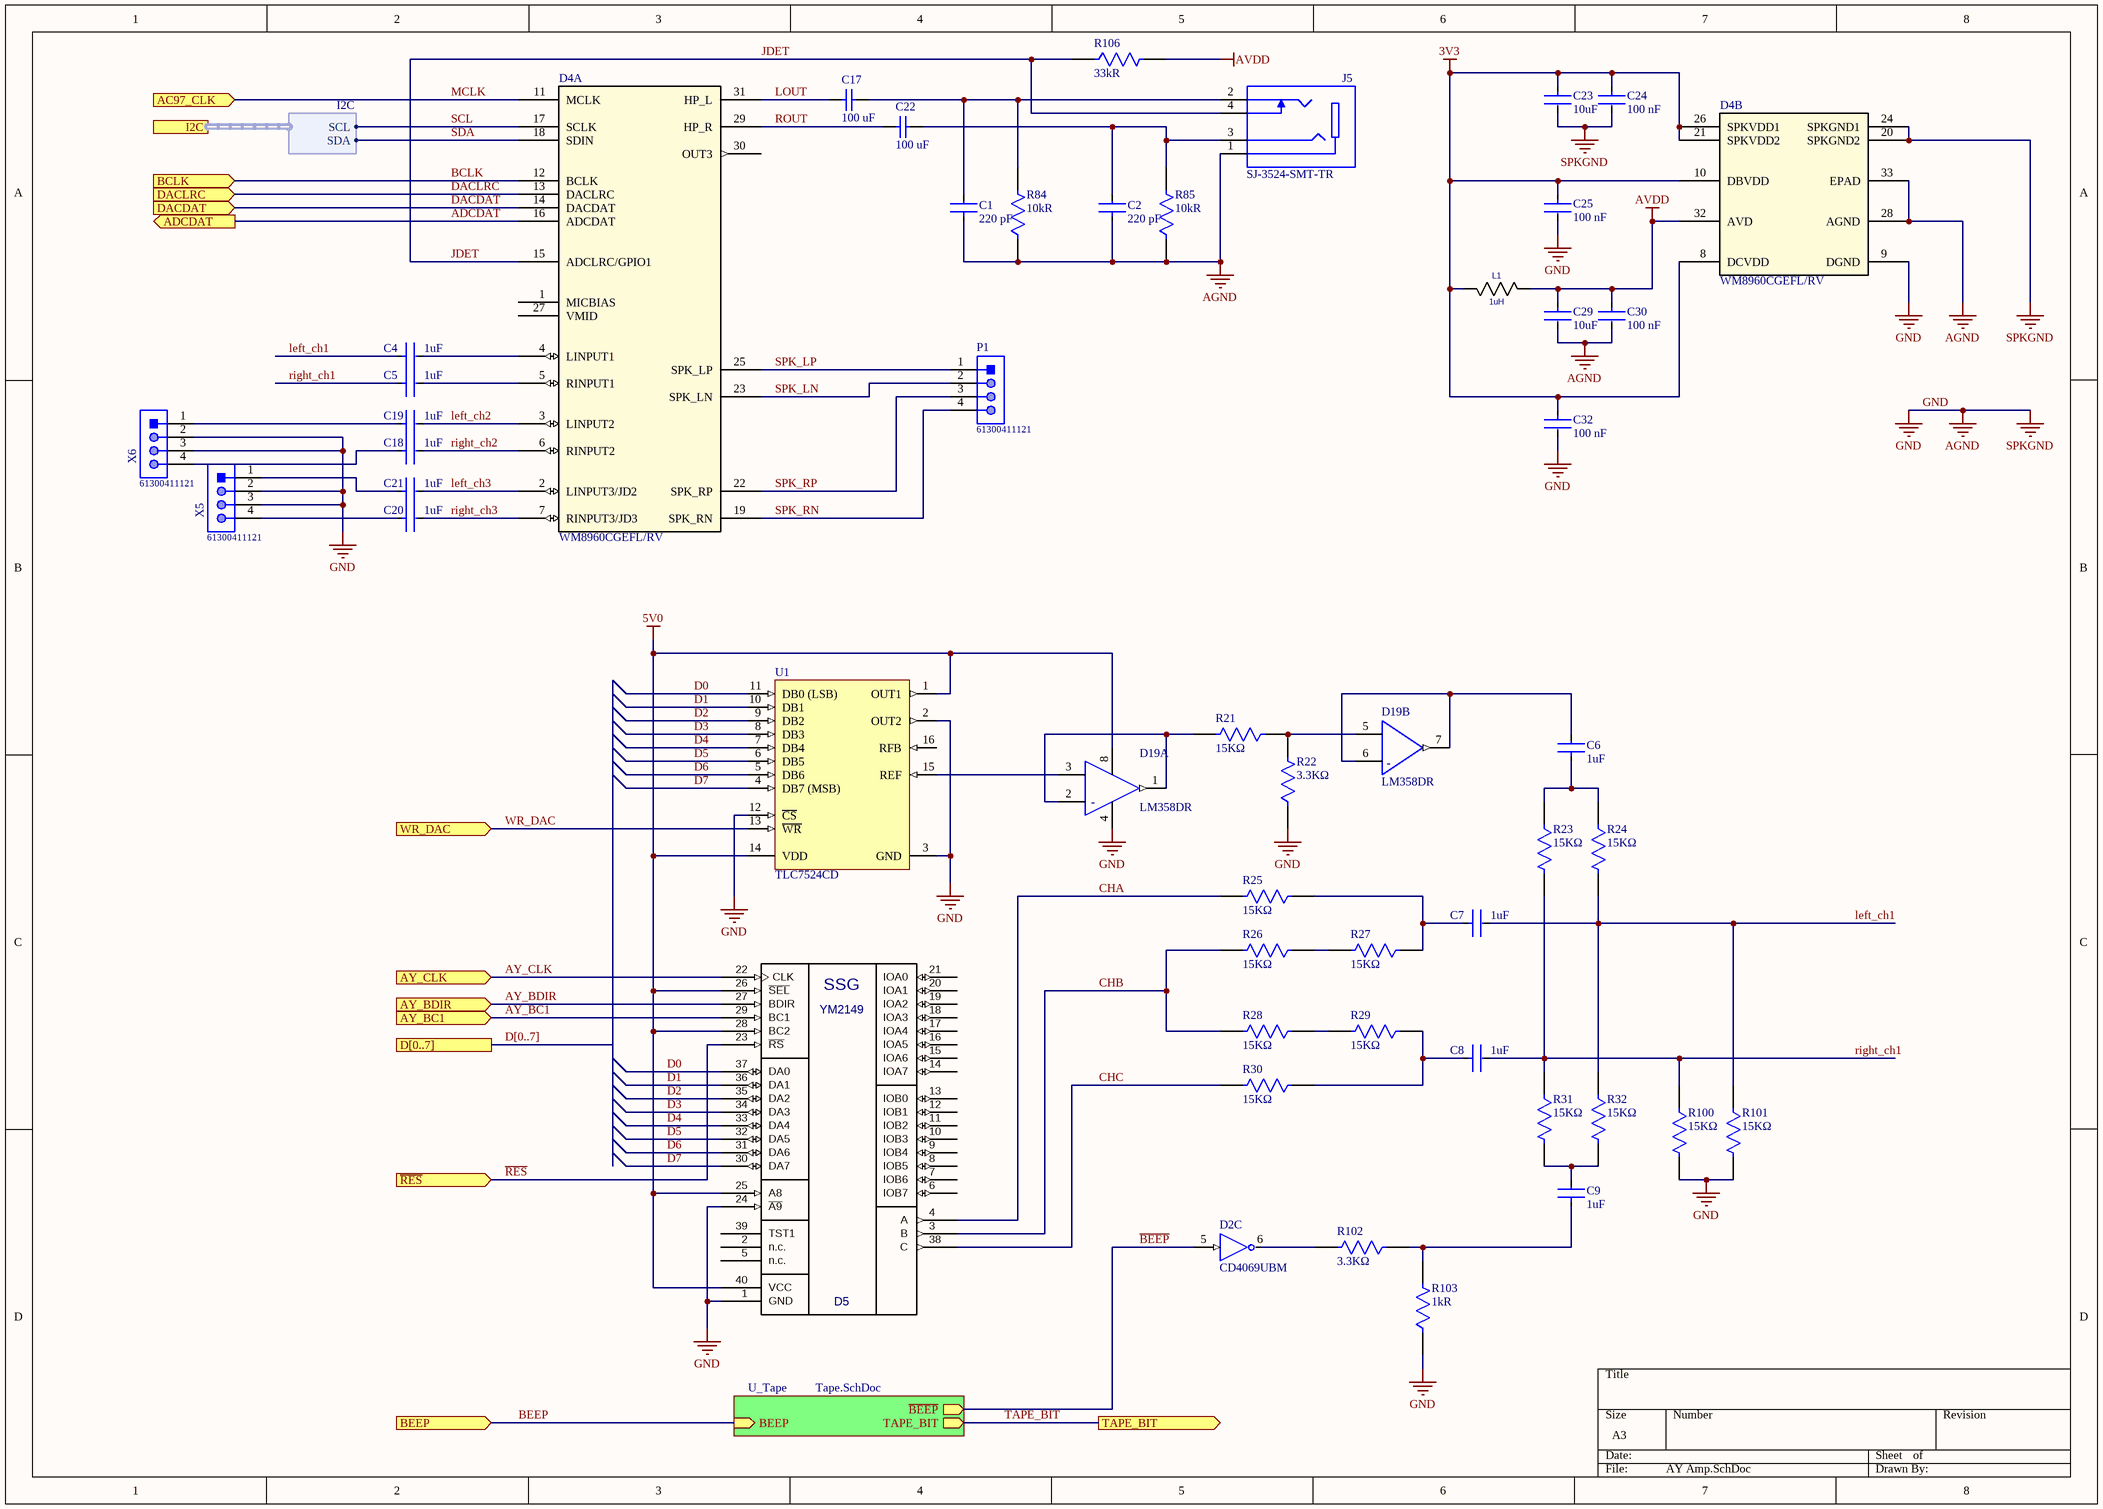
[diagram p12: AY Amp.SchDoc]

### Parts
C1  Capacitance: 220 pF  [FP-CC0805-0_85-IPC_A]  (hidden comment: CC0805KRX7R9BB221)
C2  Capacitance: 220 pF  [FP-CC0805-0_85-IPC_A]  (hidden comment: CC0805KRX7R9BB221)
C4  Capacitance: 1uF  [FP-GCM21B-0_15-IPC_A]  (hidden comment: GCM21BR71E105KA56L)
C5  Capacitance: 1uF  [FP-GCM21B-0_15-IPC_A]  (hidden comment: GCM21BR71E105KA56L)
C6  Capacitance: 1uF  [FP-GCM21B-0_15-IPC_A]  (hidden comment: GCM21BR71E105KA56L)
C7  Capacitance: 1uF  [FP-GCM21B-0_15-IPC_A]  (hidden comment: GCM21BR71E105KA56L)
C8  Capacitance: 1uF  [FP-GCM21B-0_15-IPC_A]  (hidden comment: GCM21BR71E105KA56L)
C9  Capacitance: 1uF  [FP-GCM21B-0_15-IPC_A]  (hidden comment: GCM21BR71E105KA56L)
C17  Capacitance: 100 uF  [CAPC3216X190X55ML30T25]  (hidden comment: GRM31CR60J107ME39L)
C18  Capacitance: 1uF  [FP-GCM21B-0_15-IPC_A]  (hidden comment: GCM21BR71E105KA56L)
C19  Capacitance: 1uF  [FP-GCM21B-0_15-IPC_A]  (hidden comment: GCM21BR71E105KA56L)
C20  Capacitance: 1uF  [FP-GCM21B-0_15-IPC_A]  (hidden comment: GCM21BR71E105KA56L)
C21  Capacitance: 1uF  [FP-GCM21B-0_15-IPC_A]  (hidden comment: GCM21BR71E105KA56L)
C22  Capacitance: 100 uF  [CAPC3216X190X55ML30T25]  (hidden comment: GRM31CR60J107ME39L)
C23  Capacitance: 10uF  [FP-C0805C-DG-IPC_A]  (hidden comment: C0805C106K8PACTU)
C24  Capacitance: 100 nF  [FP-CC0805-0_85-IPC_A]  (hidden comment: CC0805KRX7R9BB104)
C25  Capacitance: 100 nF  [FP-CC0805-0_85-IPC_A]  (hidden comment: CC0805KRX7R9BB104)
C29  Capacitance: 10uF  [FP-C0805C-DG-IPC_A]  (hidden comment: C0805C106K8PACTU)
C30  Capacitance: 100 nF  [FP-CC0805-0_85-IPC_A]  (hidden comment: CC0805KRX7R9BB104)
C32  Capacitance: 100 nF  [FP-CC0805-0_85-IPC_A]  (hidden comment: CC0805KRX7R9BB104)
D2  CD4069UBM  [FP-D0014A-IPC_A]  (part C of 7)
D4  WM8960CGEFL/RV  [QFN50P500X500X90_HS-33M]  (parts A,B of 2)
D5  YM2149  [DIP40]
D19  LM358DR  [FP-D0008A-MFG]  (parts A,B of 2)
J5  SJ-3524-SMT-TR  [SJ-3524-SMT-TR]
L1  value 1uH  [L-CHIP]  (hidden comment: L-CHIP)
P1  61300411121  [61300411121]
R21  Resistance: 15KΩ  [FP-RN732A-IPC_A]  (hidden comment: RN73C2A15KBTDF)
R22  Resistance: 3.3KΩ  [FP-RT0805-IPC_A]  (hidden comment: RT0805FRE073K3L)
R23  Resistance: 15KΩ  [FP-RN732A-IPC_A]  (hidden comment: RN73C2A15KBTDF)
R24  Resistance: 15KΩ  [FP-RN732A-IPC_A]  (hidden comment: RN73C2A15KBTDF)
R25  Resistance: 15KΩ  [FP-RN732A-IPC_A]  (hidden comment: RN73C2A15KBTDF)
R26  Resistance: 15KΩ  [FP-RN732A-IPC_A]  (hidden comment: RN73C2A15KBTDF)
R27  Resistance: 15KΩ  [FP-RN732A-IPC_A]  (hidden comment: RN73C2A15KBTDF)
R28  Resistance: 15KΩ  [FP-RN732A-IPC_A]  (hidden comment: RN73C2A15KBTDF)
R29  Resistance: 15KΩ  [FP-RN732A-IPC_A]  (hidden comment: RN73C2A15KBTDF)
R30  Resistance: 15KΩ  [FP-RN732A-IPC_A]  (hidden comment: RN73C2A15KBTDF)
R31  Resistance: 15KΩ  [FP-RN732A-IPC_A]  (hidden comment: RN73C2A15KBTDF)
R32  Resistance: 15KΩ  [FP-RN732A-IPC_A]  (hidden comment: RN73C2A15KBTDF)
R84  Resistance: 10kR  [FP-CR0805-IPC_A]  (hidden comment: CR0805-JW-103ELF)
R85  Resistance: 10kR  [FP-CR0805-IPC_A]  (hidden comment: CR0805-JW-103ELF)
R100  Resistance: 15KΩ  [FP-RN732A-IPC_A]  (hidden comment: RN73C2A15KBTDF)
R101  Resistance: 15KΩ  [FP-RN732A-IPC_A]  (hidden comment: RN73C2A15KBTDF)
R102  Resistance: 3.3KΩ  [FP-RT0805-IPC_A]  (hidden comment: RT0805FRE073K3L)
R103  Resistance: 1kR  [FP-CRCW0805-HPe3-IPC_A]  (hidden comment: CRCW08051K00FKEAHP)
R106  Resistance: 33kR  [FP-RMCF0805-IPC_A]  (hidden comment: RMCF0805JT33K0)
U1  TLC7524CD  [TI-D16_N]
X5  61300411121  [61300411121]
X6  61300411121  [61300411121]

### Sub-sheets
U_Tape = Tape.SchDoc: BEEP (in), TAPE_BIT (out), ~{BEEP} (out)

### Ports
AC97_CLK (in), ADCDAT (out), AY_BC1 (in), AY_BDIR (in), AY_CLK (in), BCLK (in), BEEP (in), D[0..7], DACDAT (in), DACLRC (in), I2C (harness I2C), TAPE_BIT (out), WR_DAC (in), ~{RES} (in)

### Harnesses
I2C: SDA, SCL

### Nets
3V3: C23.1 C24.1 C25.1 C32.1 D4.8(DCVDD) D4.10(DBVDD) D4.21(SPKVDD2) D4.26(SPKVDD1) L1.2
5V0: D5.25(A8) D5.26(~{SEL}) D5.28(BC2) D5.40(VCC) D19.8(V+) U1.1(OUT1) U1.14(VDD)
AVDD: C29.1 C30.1 D4.32(AVD) L1.1 R106.2
GND: C1.1 C2.1 C23.2 C24.2 C25.2 C29.2 C30.2 C32.2 D4.9(DGND) D4.20(SPKGND2) D4.24(SPKGND1) D4.28(AGND) D4.33(EPAD) D5.1(GND) D5.24(~{A9}) D19.4(V-) J5.1 R22.1 R84.1 R85.1 R100.2 R101.2 R103.1 U1.2(OUT2) U1.3(GND) U1.12(~{CS}) X5.2 X5.3 X6.2 X6.3  [also labelled AGND, SPKGND]
ADCDAT: D4.16(ADCDAT) ; port ADCDAT
AY_BC1: D5.29(BC1) ; port AY_BC1
AY_BDIR: D5.27(BDIR) ; port AY_BDIR
AY_CLK: D5.22(CLK) ; port AY_CLK
~{BEEP}: D2.5(C) ; sheet U_Tape/~{BEEP}
BCLK: D4.12(BCLK) ; port BCLK
BEEP: port BEEP, sheet U_Tape/BEEP
CHA: D5.4(A) R25.2  [project net CHA_3]
CHB: D5.3(B) R26.2 R28.2  [project net CHB_3]
CHC: D5.38(C) R30.2  [project net CHC_3]
D0: D5.37(DA0) U1.11(DB0_(LSB))
D1: D5.36(DA1) U1.10(DB1)
D2: D5.35(DA2) U1.9(DB2)
D3: D5.34(DA3) U1.8(DB3)
D4: D5.33(DA4) U1.7(DB4)
D5: D5.32(DA5) U1.6(DB5)
D6: D5.31(DA6) U1.5(DB6)
D7: D5.30(DA7) U1.4(DB7_(MSB))
DACDAT: D4.14(DACDAT) ; port DACDAT
DACLRC: D4.13(DACLRC) ; port DACLRC
JDET: D4.15(ADCLRC/GPIO1) J5.4 R106.1  [project net JDET_3]
left_ch1: C4.1 C7.2 R24.2 R32.1 R101.1  [project net left_ch1_3]
left_ch2: C19.2 D4.3(LINPUT2)  [project net left_ch2_3]
left_ch3: C21.2 D4.2(LINPUT3/JD2)  [project net left_ch3_3]
LOUT: C17.1 D4.31(HP_L)  [project net LOUT_3]
MCLK: D4.11(MCLK) ; port AC97_CLK  [project net AC97_CLK]
~{RES}: D5.23(~{RS}) ; port ~{RES}
right_ch1: C5.1 C8.2 R23.2 R31.1 R100.1  [project net right_ch1_3]
right_ch2: C18.2 D4.6(RINPUT2)  [project net right_ch2_3]
right_ch3: C20.2 D4.7(RINPUT3/JD3)  [project net right_ch3_3]
ROUT: C22.1 D4.29(HP_R)  [project net ROUT_3]
SCL: D4.17(SCLK) ; port I2C.SCL  [project net I2C.SCL]
SDA: D4.18(SDIN) ; port I2C.SDA  [project net I2C.SDA]
SPK_LN: D4.23(SPK_LN) P1.2  [project net SPK_LN_3]
SPK_LP: D4.25(SPK_LP) P1.1  [project net SPK_LP_3]
SPK_RN: D4.19(SPK_RN) P1.4  [project net SPK_RN_3]
SPK_RP: D4.22(SPK_RP) P1.3  [project net SPK_RP_3]
TAPE_BIT: port TAPE_BIT, sheet U_Tape/TAPE_BIT
WR_DAC: U1.13(~{WR}) ; port WR_DAC  [project net WRDAC]
NetC1_2: C1.2 C17.2 J5.2 R84.2
NetC2_2: C2.2 C22.2 J5.3 R85.2
NetC4_2: C4.2 D4.4(LINPUT1)
NetC5_2: C5.2 D4.5(RINPUT1)
NetC6_1: C6.1 R23.1 R24.1
NetC6_2: C6.2 D19.6(IN2-) D19.7(2OUT)
NetC7_1: C7.1 R25.1 R27.1
NetC8_1: C8.1 R29.1 R30.1
NetC9_1: C9.1 R102.1 R103.2
NetC9_2: C9.2 R31.2 R32.2
NetC18_1: C18.1 X6.4
NetC19_1: C19.1 X6.1
NetC20_1: C20.1 X5.4
NetC21_1: C21.1 X5.1
NetD2_6: D2.6(~{C}) R102.2
NetD19_1: D19.1(1OUT) D19.2(IN1-) R21.2
NetD19_3: D19.3(IN1+) U1.15(REF)
NetD19_5: D19.5(IN2+) R21.1 R22.2
NetR26_1: R26.1 R27.2
NetR28_1: R28.1 R29.2

Not connected (* = marked no-connect by the designer): D4 1(MICBIAS) 27(VMID) 30(OUT3); D5 2(n.c.) 5(n.c.) 6(IOB7) 7(IOB6) 8(IOB5) 9(IOB4) 10(IOB3) 11(IOB2) 12(IOB1) 13(IOB0) 14(IOA7) 15(IOA6) 16(IOA5) 17(IOA4) 18(IOA3) 19(IOA2) 20(IOA1) 21(IOA0) 39(TST1); U1 16(RFB)

### Buses and harness runs
bus D[0..7] = port D[0..7]

### Notes on the sheet
- (in symbol CMP-1685-00009-2, part A) -
- (in symbol CMP-1685-00009-2, part B) -
- (in symbol YM2149) SSG
- (in symbol LM358DR, part A) -
- (in symbol LM358DR, part B) -

### Library data of the parts
C1 C2 = CMP-1036-02315-3: CAP CER 220PF 50V X7R 0805; Manufacturer Part Number: VJ0805A221KXAPW1BC; Manufacturer: Vishay Vitramon; Value: 220 pF; Category: Cap; Case/Package: 0805
C4-C9 C18-C21 = CMP-2007-03346-2: as C13 on sheet ESP32; Termination: SMD/SMT; Case/Package: 0805; Manufacturer Part Number: GCM21BR71E105KA56L; value: 1uF; Category: Cap
C17 C22 = CMP-1662-00011-2: Chip Capacitor, 100 uF, +/- 20%, 6.3 V, -55 to 85 degC, 1206 (3216 Metric), RoHS, Tape and Reel; Manufacturer: Murata; value: 100 uF; PackageDescription: 2-Pin Surface Mount Device, Body 3.2 x 1.6 mm; PartNumber: GRM31CR60J107ME39L; Manufacturer Part Number: GRM31CR60J107ME39L; Case/Package: 1206; Category: Cap
C23 C29 = CMP-2007-03243-2: as C113 on sheet ESP32; Manufacturer Part Number: C0805C106K8PACTU; Value: 10uF; Category: Cap; Case/Package: 0805
C24 C25 C30 C32 = CMP-2100-03606-3: as C114 on sheet ESP32; Category: Cap; Manufacturer Part Number: CC0805KRX7R9BB104; Case/Package: 0805
D2 = CMP-1615-00195-3: IC INVERTER 6CH 6-INP 14SOIC; Manufacturer: Texas Instruments; Number of Pins: 14; Case/Package: SOIC; Manufacturer Part Number: CD4069UBM; value: CD4069UBM; Category: IC
D4 = WM8960CGEFL/RV: Stereo CODEC with 1W Stereo Class-D speaker Drivers; value: WM8960CGEFL/RV; Case/Package: QNF-32; Category: IC
D19 = CMP-1685-00009-2: IC OPAMP GP 2 CIRCUIT 8SOIC; Manufacturer: Texas Instruments; Case/Package: SOIC; Number of Pins: 8; Manufacturer Part Number: LM358DR; value: LM358DR; Category: IC
J5 = SJ-3524-SMT-TR: Connector; Case/Package: Stereo jack smd; Category: Connector; Value: SJ-3524-SMT-TR
P1 X5 X6 = CMP-1502-01064-1: THT Vertical Pin Header WR-PHD, Pitch 2.54 mm, Single Row, 4 pins; Manufacturer: Wurth Electronics; Pitch: 2.54mm; value: header 4 pin 2.54mm; Manufacturer Part Number: 61300411121; Case/Package: PLS-4; Category: Connector
R21 R23-R32 R100 R101 = CMP-03211-008328-1: SMD Chip Resistor, Thin Film, 15KΩ, 100 V, 0805 [2012 Metric], 100 mW, 0.1%, RN73 Series; Manufacturer: TE Connectivity; Manufacturer Part Number: RN73C2A15KBTDF; Category: Res; Value: 15KΩ; Case/Package: 0805
R22 R102 = CMP-03412-025935-1: as R51 on sheet ESP32; Manufacturer Part Number: RT0805FRE073K3L; Category: Res; Case/Package: 0805
R84 R85 = CMP-07231-003873-1: as R54 on sheet ESP32; value: 10kΩ; Manufacturer Part Number: CR0805-JW-103ELF; Number of Terminations: 2; Termination: SMD/SMT; Number of Pins: 2; Case/Package: 0805; Category: Res
R103 = CMP-02407-004529-1: RES Thick Film, 1kΩ, 1%, 0.5W, 100ppm/°C, 0805; Manufacturer: Vishay Dale; Case/Package: 0805; Number of Pins: 2; Termination: Solder; Manufacturer Part Number: CRCW08051K00FKEAHP; value: 1kΩ; Category: Res
R106 = CMP-26527-001097-1: 33kΩ ±5% 0.125W 0805 Thick Film Chip Resistor AEC-Q200 compliant; Manufacturer: Stackpole Electronics; Number of Terminations: 2; Case/Package: 0805; Manufacturer Part Number: RMCF0805JT33K0; value: 33kΩ; Category: Res
U1 = CMP-0004-00046-1: 8-Bit, 0.1 us MDAC, Parallel Input, Fast Control Signalling for DSP, Easy Micro Interface, 0 to 70 degC, 16-pin SOIC (D16), Green (RoHS & no Sb/Br); Manufacturer: Texas Instruments; PackageDescription: 16-Pin Plastic Small Outline, Body 9.9 x 3.9 mm, Pitch 1.27 mm; PartNumber: TLC7524CD; Manufacturer Part Number: TLC7524CD; value: TLC7524CD; Case/Package: SOIC-16; Category: IC
D5 = YM2149: Value: YM2149; Case/Package: DIP-40; Category: IC
L1 = L-CHIP: Case/Package: 0805; Category: Inductor

## Sheet Tape.SchDoc
size A4; SheetNumber: 4; SheetTotal: 15
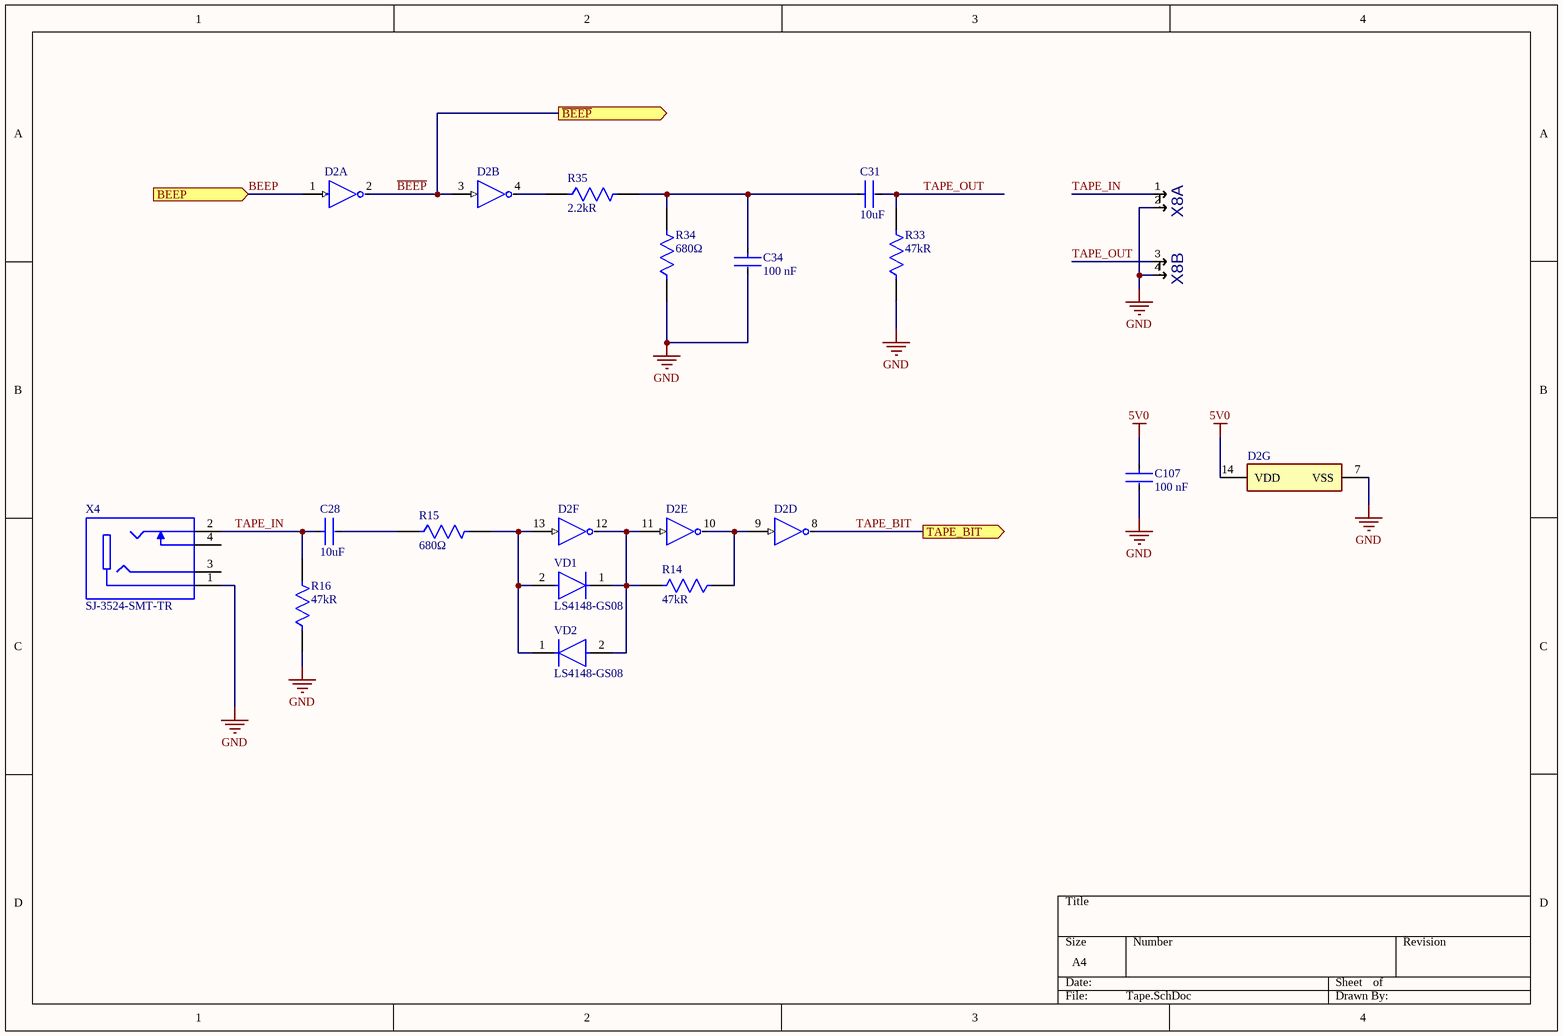
[diagram p13: Tape.SchDoc]

### Parts
C28  Capacitance: 10uF  [FP-C0805C-DG-IPC_A]  (hidden comment: C0805C106K8PACTU)
C31  Capacitance: 10uF  [FP-C0805C-DG-IPC_A]  (hidden comment: C0805C106K8PACTU)
C34  Capacitance: 100 nF  [FP-CC0805-0_85-IPC_A]  (hidden comment: CC0805KRX7R9BB104)
C107  Capacitance: 100 nF  [FP-CC0805-0_85-IPC_A]  (hidden comment: CC0805KRX7R9BB104)
D2  CD4069UBM  [FP-D0014A-IPC_A]  (value not drawn)  (parts A,B,D,E,F,G of 7)
R14  Resistance: 47kR  [FP-CRCW0805-HPe3-IPC_A]  (hidden comment: CRCW080547K0FKEAHP)
R15  value 680Ω  [FP-RT0805-IPC_A]  (hidden comment: RT0805FRE07680RL)
R16  Resistance: 47kR  [FP-CRCW0805-HPe3-IPC_A]  (hidden comment: CRCW080547K0FKEAHP)
R33  Resistance: 47kR  [FP-CRCW0805-HPe3-IPC_A]  (hidden comment: CRCW080547K0FKEAHP)
R34  value 680Ω  [FP-RT0805-IPC_A]  (hidden comment: RT0805FRE07680RL)
R35  Resistance: 2.2kR  [FP-CR0805-IPC_A]  (hidden comment: CR0805-JW-222ELF)
VD1  LS4148-GS08  [FP-6_560-5006_01-4-MFG]
VD2  LS4148-GS08  [FP-6_560-5006_01-4-MFG]
X4  SJ-3524-SMT-TR  [SJ-3524-SMT-TR]
X8  PLB2-2  [PLB2-2]  (value not drawn)  (parts A,B of 2)

### Ports
BEEP (in), TAPE_BIT (out), ~{BEEP} (out)

### Nets
5V0: C107.1 D2.14(VDD)
GND: C34.2 C107.2 D2.7(VSS) R16.1 R33.1 R34.1 X4.1 X8.2 X8.4
~{BEEP}: D2.2(~{A}) D2.3(B) ; port ~{BEEP}
BEEP: D2.1(A) ; port BEEP
TAPE_BIT: D2.8(~{D}) ; port TAPE_BIT
TAPE_IN: C28.1 R16.2 X4.2 X8.1  [project net TAPE_IN_4]
TAPE_OUT: C31.2 R33.2 X8.3  [project net TAPE_OUT_4]
NetC28_2: C28.2 R15.1
NetC31_1: C31.1 C34.1 R34.2 R35.2
NetD2_4: D2.4(~{B}) R35.1
NetD2_9: D2.9(D) D2.10(~{E}) R14.1
NetD2_11: D2.11(E) D2.12(~{F}) R14.2 VD1.1(C) VD2.2(A)
NetD2_13: D2.13(F) R15.2 VD1.2(A) VD2.1(C)

Not connected (* = marked no-connect by the designer): X4 3 4

### Library data of the parts
C28 C31 = CMP-2007-03243-2: as C113 on sheet ESP32; Manufacturer Part Number: C0805C106K8PACTU; Value: 10uF; Category: Cap; Case/Package: 0805
C34 C107 = CMP-2100-03606-3: as C114 on sheet ESP32; Manufacturer Part Number: CC0805KRX7R9BB104; Category: Cap; Case/Package: 0805
D2 = CMP-1615-00195-3: as D2 on sheet AY Amp; Number of Pins: 14; Case/Package: SOIC; Manufacturer Part Number: CD4069UBM; value: CD4069UBM; Category: IC
R14 R16 R33 = CMP-02407-008731-1: RES Thick Film, 47kΩ, 1%, 0.5W, 100ppm/°C, 0805; Manufacturer: Vishay; Number of Terminations: 2; Termination: SMD/SMT; Case/Package: 0805; Manufacturer Part Number: CRCW080547K0FKEAHP; value: 47kΩ; Category: Res
R15 R34 = CMP-03412-000082-1: as R98 on sheet ESP32; Category: Res; Manufacturer Part Number: RT0805FRE07680RL; Resistance: 680Ω; Case/Package: 0805
R35 = CMP-07231-003724-1: Thick Film Chip Resistors 0805 2.2kΩ 0.125W 5% 200ppm/°C; Manufacturer: Bourns; Number of Terminations: 2; Termination: SMD/SMT; Case/Package: 0805; Manufacturer Part Number: CR0805-JW-222ELF; value: 2.2kΩ; Category: Res
VD1 VD2 = CMP-02540-000025-1: DIODE GEN PURP 75V 150MA SOD80; Manufacturer: Vishay; Capacitance: 4pF; Value: LS4148; Category: Diode; Manufacturer Part Number: LS4148-GS08; Case/Package: SOD80
X4 = SJ-3524-SMT-TR: Connector; Case/Package: Stereo jack smd; Category: Connector; Value: SJ-3524-SMT-TR
X8 = PLB2-2: Value: PLD-4; Case/Package: PLD-4; Category: Connector

## Sheet PLL.SchDoc
size A4; SheetNumber: 15; SheetTotal: 15
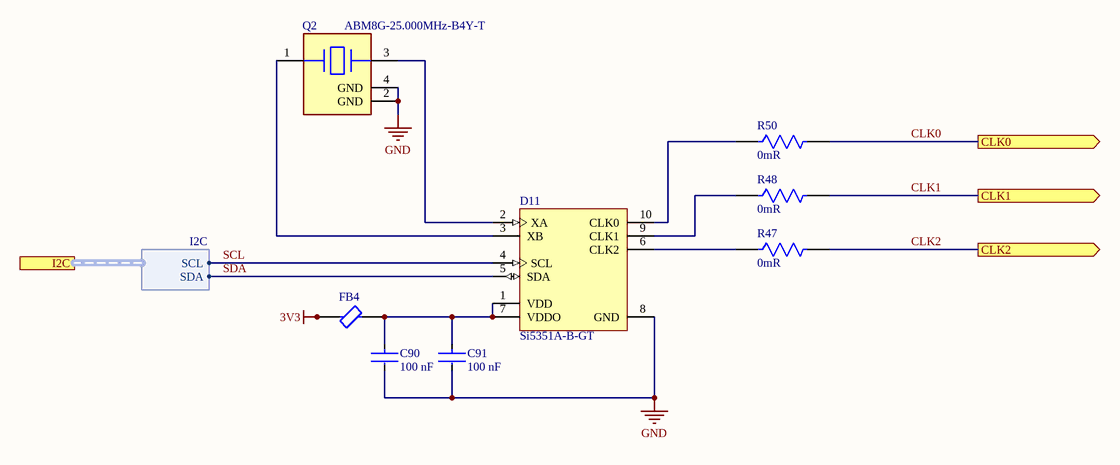
[diagram p14: PLL.SchDoc]

### Parts
C90  Capacitance: 100 nF  [FP-CC0805-0_85-IPC_A]  (hidden comment: CC0805KRX7R9BB104)
C91  Capacitance: 100 nF  [FP-CC0805-0_85-IPC_A]  (hidden comment: CC0805KRX7R9BB104)
D11  Si5351A-B-GT  [SLAB-MSOP-10_L]
FB4  BLM21AG601SN1J  [FP-BLM21-0_2-t0_85-e0_5-IPC_A]  (value not drawn)
Q2  ABM8G-25.000MHz-B4Y-T  [FP-ABM8G-MFG]
R47  Resistance: 0mR  [FP-CR0805-IPC_A]  (hidden comment: CR0805-J/-000ELF)
R48  Resistance: 0mR  [FP-CR0805-IPC_A]  (hidden comment: CR0805-J/-000ELF)
R50  Resistance: 0mR  [FP-CR0805-IPC_A]  (hidden comment: CR0805-J/-000ELF)

### Ports
CLK0 (out), CLK1 (out), CLK2 (out), I2C (harness I2C)

### Harnesses
I2C: SDA, SCL

### Nets
3V3: FB4.1
GND: C90.2 C91.2 D11.8(GND) Q2.2(GND) Q2.4(GND)
CLK0: R50.2 ; port CLK0  [project net FPGA_CLK]
CLK1: R48.2 ; port CLK1  [project net AC97_CLK]
CLK2: R47.2 ; port CLK2  [project net AY_CLK]
SCL: D11.4(SCL) ; port I2C.SCL  [project net I2C.SCL]
SDA: D11.5(SDA) ; port I2C.SDA  [project net I2C.SDA]
NetC90_1: C90.1 C91.1 D11.1(VDD) D11.7(VDDO) FB4.2
NetD11_2: D11.2(XA) Q2.3
NetD11_3: D11.3(XB) Q2.1
NetD11_6: D11.6(CLK2) R47.1
NetD11_9: D11.9(CLK1) R48.1
NetD11_10: D11.10(CLK0) R50.1

### Library data of the parts
C90 C91 = CMP-2100-03606-3: as C114 on sheet ESP32; Category: Cap; Manufacturer Part Number: CC0805KRX7R9BB104; Case/Package: 0805
D11 = CMP-0510-00012-1: I2C-Programmable Any-Frequency CMOS Clock Generator + VCXO, 2.5 / 3.3 V, 0.008 to 160 MHz Output, -40 to 85 degC, 10-pin SOP; Manufacturer: Silicon Labs; PackageDescription: 10-Pin Mini Small Outline Package, Body 3 x 3 mm, Pitch 0.5 mm; PartNumber: Si5351A-B-GT; Manufacturer Part Number: SI5351A-B-GT; value: SI5351A-B-GT; Case/Package: MSOP-10; Category: IC
FB4 = CMP-0686-00643-3: Chip Ferrite Bead, 0805, 600Ω @ 100MHz, 0.2Ω, 25%, 700mA; Manufacturer: Murata; Number of Pins: 2; Case/Package: 0805; Termination: Flat; Manufacturer Part Number: BLM21AG601SN1J; value: BLM21AG601SN1J; Category: Inductor
Q2 = CMP-27762-000021-1: CRYSTAL 25.0000MHZ 10PF SMD; Manufacturer: Abracon; Termination: SMD/SMT; Case/Package: SMD/SMT; Number of Pins: 4; Manufacturer Part Number: ABM8G-25.000MHZ-B4Y-T; value: ABM8G-25.000MHZ-B4Y-T; Category: CrystalsandOscillators
R47 R48 R50 = CMP-07231-004348-1: Thick Film Chip Resistors 0805 0Ω 0.125W 5%; Manufacturer: Bourns; Case/Package: 0805; Number of Pins: 2; Termination: SMD/SMT; Manufacturer Part Number: CR0805-J/-000ELF; value: 0Ω; Category: Res

## Sheet Gamepads.SchDoc
size A4; SheetNumber: 10; SheetTotal: 15
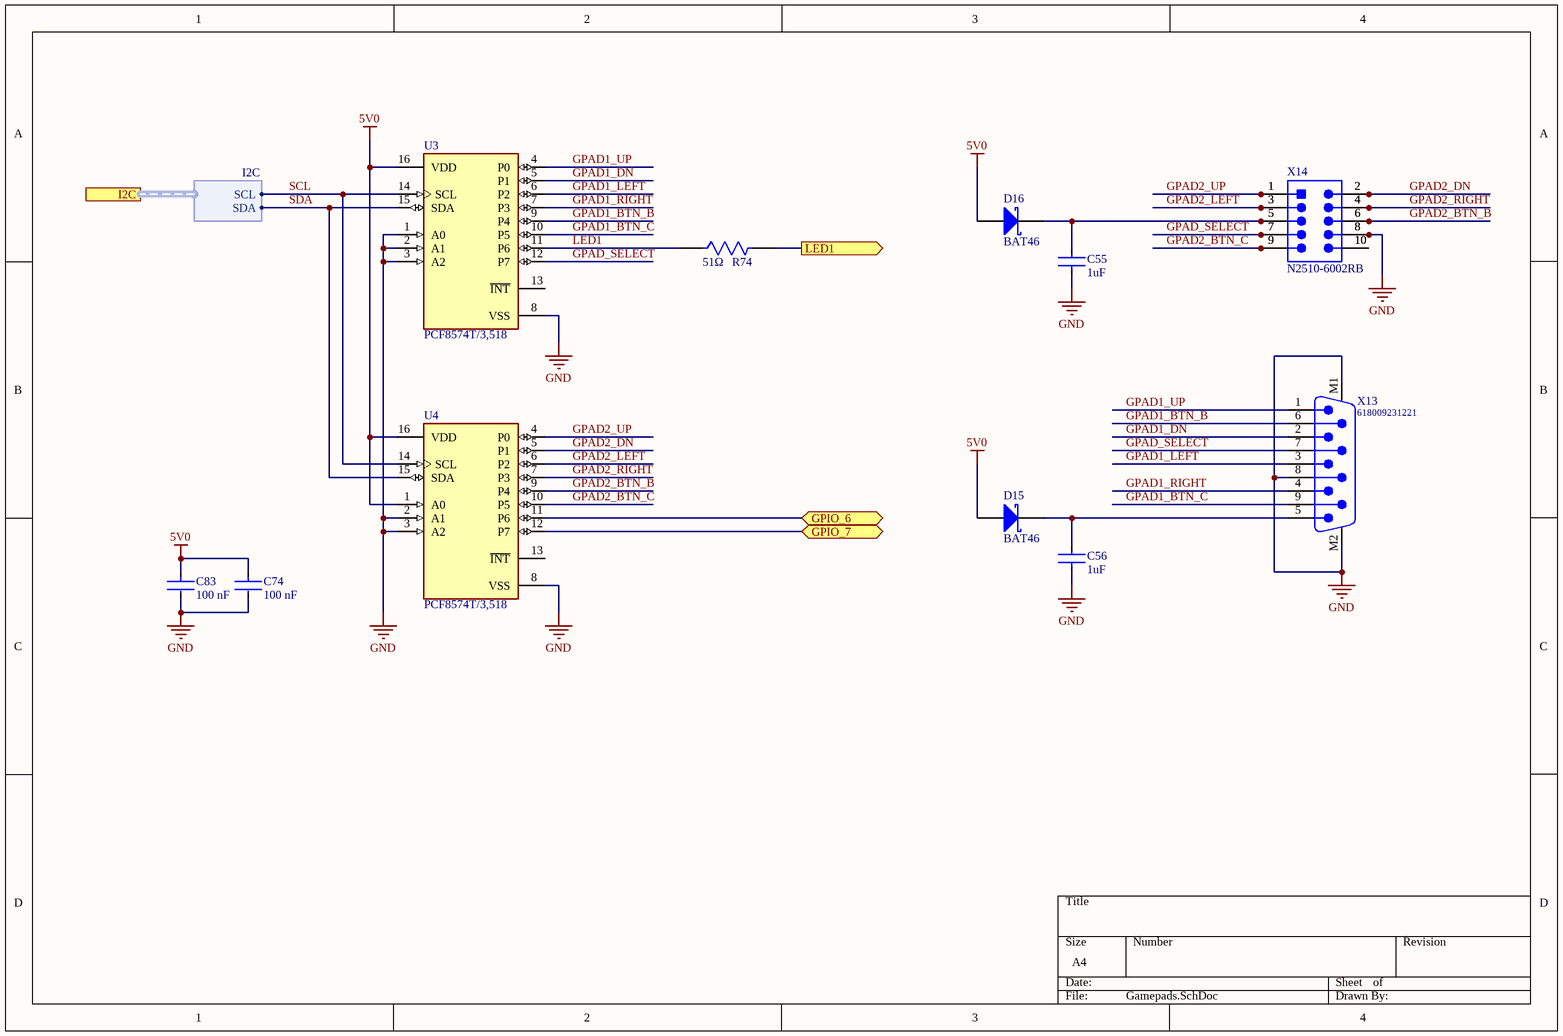
[diagram p15: Gamepads.SchDoc]

### Parts
C55  Capacitance: 1uF  [FP-GCM21B-0_15-IPC_A]  (hidden comment: GCM21BR71E105KA56L)
C56  Capacitance: 1uF  [FP-GCM21B-0_15-IPC_A]  (hidden comment: GCM21BR71E105KA56L)
C74  Capacitance: 100 nF  [FP-CC0805-0_85-IPC_A]  (hidden comment: CC0805KRX7R9BB104)
C83  Capacitance: 100 nF  [FP-CC0805-0_85-IPC_A]  (hidden comment: CC0805KRX7R9BB104)
D15  BAT46  [STM-DO-35-2]
D16  BAT46  [STM-DO-35-2]
R74  Resistance: 51Ω  [FP-RR1220-IPC_A]  (hidden comment: RR1220Q-510-D)
U3  PCF8574T/3,518  [FP-SOT162-1-MFG]
U4  PCF8574T/3,518  [FP-SOT162-1-MFG]
X13  618009231221  [618009231221]
X14  N2510-6002RB  [3M-N2510-6002-10_V]

### Ports
GPIO_6 (bidir), GPIO_7 (bidir), I2C (harness I2C), LED1 (out)

### Harnesses
I2C: SDA, SCL

### Nets
5V0: C74.1 C83.1 D15.1(A) D16.1(A) U3.16(VDD) U4.1(A0) U4.16(VDD)
GND: C55.1 C56.1 C74.2 C83.2 U3.1(A0) U3.2(A1) U3.3(A2) U3.8(VSS) U4.2(A1) U4.3(A2) U4.8(VSS) X13.8 X13.M1 X13.M2 X14.8
GPAD1_BTN_B: U3.9(P4) X13.6  [project net GPAD1_BTN_B_10]
GPAD1_BTN_C: U3.10(P5) X13.9  [project net GPAD1_BTN_C_10]
GPAD1_DN: U3.5(P1) X13.2  [project net GPAD1_DN_10]
GPAD1_LEFT: U3.6(P2) X13.3  [project net GPAD1_LEFT_10]
GPAD1_RIGHT: U3.7(P3) X13.4  [project net GPAD1_RIGHT_10]
GPAD1_UP: U3.4(P0) X13.1  [project net GPAD1_UP_10]
GPAD2_BTN_B: U4.9(P4) X14.6  [project net GPAD2_BTN_B_10]
GPAD2_BTN_C: U4.10(P5) X14.9  [project net GPAD2_BTN_C_10]
GPAD2_DN: U4.5(P1) X14.2  [project net GPAD2_DN_10]
GPAD2_LEFT: U4.6(P2) X14.3  [project net GPAD2_LEFT_10]
GPAD2_RIGHT: U4.7(P3) X14.4  [project net GPAD2_RIGHT_10]
GPAD2_UP: U4.4(P0) X14.1  [project net GPAD2_UP_10]
GPAD_SELECT: U3.12(P7) X13.7 X14.7  [project net GPAD_SELECT_10]
LED1: R74.1 U3.11(P6)  [project net LED1_10]
SCL: U3.14(SCL) U4.14(SCL) ; port I2C.SCL  [project net I2C.SCL]
SDA: U3.15(SDA) U4.15(SDA) ; port I2C.SDA  [project net I2C.SDA]
NetC55_2: C55.2 D16.2(K) X14.5
NetC56_2: C56.2 D15.2(K) X13.5
NetR74_2: R74.2 ; port LED1
NetU4_11: U4.11(P6) ; port GPIO_6
NetU4_12: U4.12(P7) ; port GPIO_7

Not connected (* = marked no-connect by the designer): U3 13(~{INT}); U4 13(~{INT}); X14 10

### Library data of the parts
C55 C56 = CMP-2007-03346-2: as C13 on sheet ESP32; Termination: SMD/SMT; Case/Package: 0805; Manufacturer Part Number: GCM21BR71E105KA56L; value: 1uF; Category: Cap
C74 C83 = CMP-2100-03606-3: as C114 on sheet ESP32; Category: Cap; Manufacturer Part Number: CC0805KRX7R9BB104; Case/Package: 0805
D15 D16 = CMP-2000-05926-1: Small Signal Schottky Diode, 150 mA, 100 V, -65 to 125 degC, 2-Pin DO-35, RoHS, Tape and Reel; Manufacturer: STMicroelectronics; Manufacturer Part Number: BAT46; value: BAT46; Category: Diode
R74 = CMP-2001-03561-2: 51Ω ±0.5% 0.1W 1/10W Chip Resistor 0805 (2012 Metric) Thin Film; Manufacturer: Susumu; Case/Package: 0805; Number of Terminations: 2; Termination: SMD/SMT; Number of Pins: 2; Manufacturer Part Number: RR1220Q-510-D; value: 51Ω; Category: Res
U3 U4 = CMP-10112-000010-1: IC I/O EXPANDER I2C 8B 16SOIC; Manufacturer: NXP Semiconductors; Manufacturer Part Number: PCF8574T/3,518; Category: IC; value: PCF8574T/3,518; Case/Package: SOT162-1
X13 = CMP-1502-00284-1: Male PCB Connector with Hex Screw WR-DSUB, 8.08 mm, Angled, 9 pins; Manufacturer: Wurth Electronics; value: DSUB, Angled, 9 pins; Manufacturer Part Number: 618009231221; Case/Package: DSUB-9; Category: Connector
X14 = CMP-2000-06794-1: as X2 on sheet ESP32; Manufacturer Part Number: N2510-6002RB; Case/Package: IDC-10; Category: Connector

## Nets that join several sheets
2V5: FPGA (12 pins), Power ATX (8 pins)
3V3: FPGA (22 pins), CPLD (16 pins), Video out (8 pins), SDCARD (7 pins), Power ATX (10 pins), USB (C38.1 D8.4 D8.16), ESP32 (14 pins), AY Amp (9 pins), PLL (FB4.1)
5V0: FPGA (6 pins), Memory (14 pins), CPU ROM (13 pins), BUS (10 pins), FDC (18 pins), Power ATX (9 pins), USB (13 pins), ESP32 (6 pins), AY Amp (7 pins), Tape (C107.1 D2.14), Gamepads (7 pins)
GND: FPGA (36 pins), Memory (14 pins), CPU ROM (5 pins), BUS (18 pins), FDC (28 pins), CPLD (16 pins), Video out (26 pins), SDCARD (12 pins), Power ATX (29 pins), USB (31 pins), ESP32 (23 pins), AY Amp (30 pins), Tape (9 pins), PLL (5 pins), Gamepads (15 pins)
STB_3V3: Power ATX (VD4.3), ESP32 (5 pins)
VCC12: BUS (C3.1 J1.0), FDC (VD3.1), Power ATX (PWR1.10)
A0: FPGA (D9.44), CPU ROM (D1.27 D18.12), BUS (XS1.A9 XS2.A9)
A1: FPGA (D9.41), CPU ROM (D1.28 D18.11), BUS (XS1.A10 XS2.A10)
A2: FPGA (D9.40), CPU ROM (D1.29 D18.10), BUS (XS1.A11 XS2.A11)
A3: FPGA (D9.39), CPU ROM (D1.30 D18.9), BUS (XS1.A12 XS2.A12)
A4: FPGA (D9.38), CPU ROM (D1.31 D18.8), BUS (XS1.A24 XS2.A24)
A5: FPGA (D9.37), CPU ROM (D1.32 D18.7), BUS (XS1.A23 XS2.A23), FDC (D6.5)
A6: FPGA (D9.36), CPU ROM (D1.34 D18.6), BUS (XS1.A22 XS2.A22), FDC (D6.6)
A7: FPGA (D9.31), CPU ROM (D1.35 D18.5), BUS (XS1.A21 XS2.A21)
A8: FPGA (D9.30), CPU ROM (D1.36 D18.27), BUS (XS1.B26 XS2.B26)
A9: FPGA (D9.29), CPU ROM (D1.37 D18.26), BUS (XS1.A27 XS2.A27)
A10: FPGA (D9.28), CPU ROM (D1.38 D18.23), BUS (XS1.B27 XS2.B27)
A11: FPGA (D9.27), CPU ROM (D1.40 D18.25), BUS (XS1.A28 XS2.A28)
A12: FPGA (D9.26), CPU ROM (D1.41 D18.4), BUS (XS1.A2 XS2.A2)
A13: FPGA (D9.25), CPU ROM (D1.42 D18.28), BUS (XS1.B2 XS2.B2)
A14: FPGA (D9.24), CPU ROM (D1.43), BUS (XS1.A1 XS2.A1)
A15: FPGA (D9.19), CPU ROM (D1.44), BUS (XS1.B1 XS2.B1)
AC97_CLK: AY Amp (D4.11), PLL (R48.2)
ADCDAT: ESP32 (D17.35), AY Amp (D4.16)
ATX_POWERON: Power ATX (VT1.1), ESP32 (R64.2)
AY_BC1: FPGA (D9.136), AY Amp (D5.29)
AY_BDIR: FPGA (D9.135), AY Amp (D5.27)
AY_CLK: AY Amp (D5.22), PLL (R47.2)
~{BEEP}: AY Amp (D2.5), Tape (D2.2 D2.3)
~{BUSA}: CPU ROM (D1.20), BUS (XS1.A26 XS2.A26)
~{BUSR}: CPU ROM (D1.22 R8.2), BUS (XS1.A19 XS2.A19)
BCLK: ESP32 (D17.32), AY Amp (D4.12)
BEEP: FPGA (D9.133 R83.1), Tape (D2.1)
~{CONFIG}: FPGA (D9.105), ESP32 (D17.22 R75.1)
~{CPLD_SSEL}: CPLD (U7.73), ESP32 (D17.15 R63.2)
~{CSROM}: FPGA (D3.6), BUS (R10.2 XS1.A25 XS2.A25)
CLKZ: FPGA (R18.2), CPU ROM (D1.1)
CONFDONE: FPGA (D9.2), ESP32 (D17.17 R66.1)
D0: FPGA (D9.18), CPU ROM (D1.9 D18.13), BUS (XS1.B6 XS2.B6), FDC (D6.7), AY Amp (D5.37 U1.11)
D1: FPGA (D9.17), CPU ROM (D1.10 D18.14), BUS (XS1.B7 XS2.B7), FDC (D6.8), AY Amp (D5.36 U1.10)
D2: FPGA (D9.16), CPU ROM (D1.7 D18.15), BUS (XS1.B8 XS2.B8), FDC (D6.9), AY Amp (D5.35 U1.9)
D3: FPGA (D9.15), CPU ROM (D1.3 D18.17), BUS (XS1.B11 XS2.B11), FDC (D6.10), AY Amp (D5.34 U1.8)
D4: FPGA (D9.14), CPU ROM (D1.2 D18.18), BUS (XS1.B12 XS2.B12), FDC (D6.11), AY Amp (D5.33 U1.7)
D5: FPGA (D9.13), CPU ROM (D1.4 D18.19), BUS (XS1.B10 XS2.B10), FDC (D6.12), AY Amp (D5.32 U1.6)
D6: FPGA (D9.12), CPU ROM (D1.5 D18.20), BUS (XS1.B9 XS2.B9), FDC (D6.13), AY Amp (D5.31 U1.5)
D7: FPGA (D9.11), CPU ROM (D1.8 D18.21), BUS (XS1.B3 XS2.B3), FDC (D6.14), AY Amp (D5.30 U1.4)
~{DOS}: FPGA (D9.160), CPU ROM (D18.3), BUS (XS1.A4 XS2.A4)
DAC_CLK: FPGA (D9.103), CPLD (U7.12), Video out (U6.24)
DACDAT: ESP32 (D17.34), AY Amp (D4.14)
DACLRC: ESP32 (D17.33), AY Amp (D4.13)
DATA0: FPGA (D9.156), ESP32 (D17.11)
DCLK: FPGA (D9.155), ESP32 (D17.10 R76.1)
DTR: USB (D8.13), ESP32 (Q6.2 R93.2)
ESP32_MASTER.MISO: CPLD (U7.83), ESP32 (D17.28 R99.2)
ESP32_MASTER.MOSI: CPLD (U7.81), ESP32 (D17.30 R105.2)
ESP32_MASTER.~{SSEL}: CPLD (U7.78), ESP32 (D17.31 R104.2)
ESP32_MASTER.SCLK: CPLD (U7.82), ESP32 (D17.29 R98.2)
ESP32_RXD: USB (D8.3), ESP32 (D17.36)
ESP32_SLAVE.MISO: CPLD (U7.86), ESP32 (D17.19)
ESP32_SLAVE.MOSI: CPLD (U7.84), ESP32 (D17.21)
ESP32_SLAVE.~{SSEL}: CPLD (U7.87), ESP32 (D17.18)
ESP32_SLAVE.SCLK: CPLD (U7.85), ESP32 (D17.20)
ESP32_TXD: USB (D8.2), ESP32 (D17.37)
FPGA_CLK: FPGA (D9.183), PLL (R50.2)
FPGA_SEL0: FPGA (D9.97), CPLD (U7.74)
FPGA_SEL1: FPGA (D9.99), CPLD (U7.75)
~{HALT}: CPU ROM (D1.14), BUS (XS1.B15 XS2.B15)
HSYNC: FPGA (D9.111), CPLD (U7.51), Video out (R91.1)
I2C.SCL: FPGA (X22.3 X23.3 X24.3), ESP32 (D17.38 R51.2), AY Amp (D4.17), PLL (D11.4), Gamepads (U3.14 U4.14)
I2C.SDA: FPGA (X22.2 X23.2 X24.2), ESP32 (D17.39 R52.2), AY Amp (D4.18), PLL (D11.5), Gamepads (U3.15 U4.15)
~{INT}: FPGA (D9.10), CPU ROM (D1.12 R1.1), BUS (XS1.B13 XS2.B13)
~{IORQ}: FPGA (D9.7), CPU ROM (D1.16 R4.2)
~{IORQ1}: FPGA (D9.148), BUS (XS1.B17)
~{IORQ2}: FPGA (D9.149), BUS (XS1.B31 XS2.B17)
IORQGE1: FPGA (D9.78), BUS (R11.2 XS1.A13)
IORQGE2: FPGA (D9.80), BUS (R9.2 XS1.A31 XS2.A13)
~{M1}: FPGA (D9.144), CPU ROM (D1.24), BUS (XS1.B24 XS2.B24)
~{MREQ}: FPGA (D9.8), CPU ROM (D1.15 R3.2), BUS (XS1.B16 XS2.B16)
~{NMI}: FPGA (D9.9), CPU ROM (D1.13 R2.1), BUS (XS1.B14 XS2.B14)
NetR74_2: FPGA (VD5.A), Gamepads (R74.2)
~{RD}: FPGA (D9.141), CPU ROM (D1.18 R5.2), BUS (XS1.B18 XS2.B18), FDC (D6.4)
~{RDROM}: CPU ROM (D18.22), BUS (R10.1 XS1.A15 XS2.A15)
~{RES}: FPGA (R13.2), CPU ROM (D1.23), BUS (XS1.A20 XS2.A20), AY Amp (D5.23)
~{RFSH}: FPGA (D9.147), CPU ROM (D1.25), BUS (XS1.B25 XS2.B25)
~{RLCAS}: FPGA (R41.2), Memory (RAM1.31 RAM2.31)
~{ROMOE}: FPGA (D9.167), CPU ROM (D18.24)
~{ROMWE}: FPGA (D9.166), CPU ROM (D18.31)
~{RRAS0}: FPGA (R42.2), Memory (RAM2.14)
~{RRAS1}: FPGA (R39.2), Memory (RAM1.14)
~{RUCAS}: FPGA (R40.2), Memory (RAM1.29 RAM1.30 RAM2.29 RAM2.30)
~{RWE}: FPGA (D9.187), Memory (RAM1.13 RAM2.13)
RA0: FPGA (D9.177), Memory (RAM1.17 RAM2.17)
RA1: FPGA (D9.175), Memory (RAM1.18 RAM2.18)
RA2: FPGA (D9.173), Memory (RAM1.19 RAM2.19)
RA3: FPGA (D9.170), Memory (RAM1.20 RAM2.20)
RA4: FPGA (D9.169), Memory (RAM1.23 RAM2.23)
RA5: FPGA (D9.172), Memory (RAM1.24 RAM2.24)
RA6: FPGA (D9.174), Memory (RAM1.25 RAM2.25)
RA7: FPGA (D9.176), Memory (RAM1.26 RAM2.26)
RA8: FPGA (D9.179), Memory (RAM1.27 RAM2.27)
RA9: FPGA (D9.180), Memory (RAM1.28 RAM2.28)
RD0: FPGA (D9.208), Memory (RAM1.2 RAM2.2)
RD1: FPGA (D9.206), Memory (RAM1.3 RAM2.3)
RD2: FPGA (D9.204), Memory (RAM1.4 RAM2.4)
RD3: FPGA (D9.202), Memory (RAM1.5 RAM2.5)
RD4: FPGA (D9.199), Memory (RAM1.7 RAM2.7)
RD5: FPGA (D9.197), Memory (RAM1.8 RAM2.8)
RD6: FPGA (D9.195), Memory (RAM1.9 RAM2.9)
RD7: FPGA (D9.192), Memory (RAM1.10 RAM2.10)
RD8: FPGA (D9.191), Memory (RAM1.33 RAM2.33)
RD9: FPGA (D9.193), Memory (RAM1.34 RAM2.34)
RD10: FPGA (D9.196), Memory (RAM1.35 RAM2.35)
RD11: FPGA (D9.198), Memory (RAM1.36 RAM2.36)
RD12: FPGA (D9.200), Memory (RAM1.38 RAM2.38)
RD13: FPGA (D9.203), Memory (RAM1.39 RAM2.39)
RD14: FPGA (D9.205), Memory (RAM1.40 RAM2.40)
RD15: FPGA (D9.207), Memory (RAM1.41 RAM2.41)
ROMPG2: FPGA (D9.164), CPU ROM (D18.2)
ROMPG3: FPGA (D9.163), CPU ROM (D18.30)
ROMPG4: FPGA (D9.162), CPU ROM (D18.1)
RS: FPGA (R12.2), CPU ROM (D18.29), BUS (XS1.A16 XS2.A16)
RTS: USB (D8.14), ESP32 (Q5.2 R94.2)
~{SD0_SSEL}: CPLD (U7.92), SDCARD (CD1.2)
~{SD1_SSEL}: CPLD (U7.88), SDCARD (CD2.2 X25.1)
~{SOFTRST}: CPLD (U7.4), USB (U2.17), ESP32 (5 pins)
~{SPI_SLAVE_IRQ}: FPGA (D9.159), ESP32 (D17.25)
~{SPI_SLAVE_SSEL}: FPGA (D9.182), CPLD (U7.5)
~{STATUS}: FPGA (D9.52), ESP32 (D17.12 R65.1)
SD0_MISO: CPLD (U7.97), SDCARD (CD1.7 R81.1)
SD0_MOSI: CPLD (U7.95), SDCARD (CD1.3)
SD0_SCLK: CPLD (U7.96), SDCARD (CD1.5)
SD1_MISO: CPLD (U7.91), SDCARD (CD2.7 R78.1 X25.6)
SD1_MOSI: CPLD (U7.89), SDCARD (CD2.3 X25.2)
SD1_SCLK: CPLD (U7.90), SDCARD (CD2.5 X25.4)
SPI_HOST.MISO: FPGA (D9.115), CPLD (U7.48)
SPI_HOST.MOSI: FPGA (D9.116), CPLD (U7.47)
SPI_HOST.~{SSEL}: FPGA (D9.119), CPLD (U7.44)
SPI_HOST.SCLK: FPGA (R60.2), CPLD (U7.49)
SPI_SLAVE.MISO: FPGA (D9.157), CPLD (U7.7)
SPI_SLAVE.MOSI: FPGA (D9.158), CPLD (U7.8)
SPI_SLAVE.SCLK: FPGA (D9.184), CPLD (U7.6)
STEP: FPGA (D9.46), FDC (D6.15 D12.5)
TAPE_BIT: ESP32 (D17.23), Tape (D2.8)
TCK_FPGA: FPGA (D9.1 R72.2 X15.1), CPLD (U7.24)
TDO_CPLD: FPGA (X15.3), CPLD (U7.25)
TDO_FPGA: FPGA (D9.4), CPLD (U7.23)
TMS_FPGA: FPGA (D9.50 R73.2 X15.5), CPLD (U7.22)
USB_n: USB (U2.15), ESP32 (D17.13 X17.1)
USB_p: USB (U2.16), ESP32 (D17.14 X17.2)
~{VG_CS}: FPGA (D9.45), FDC (D6.3 R62.1)
~{VG_RES}: FPGA (D9.54), FDC (D6.19 D10.3 R38.2)
VDAT0: FPGA (D9.96), CPLD (U7.52)
VDAT1: FPGA (D9.94), CPLD (U7.54)
VDAT2: FPGA (D9.92), CPLD (U7.56)
VDAT3: FPGA (D9.89), CPLD (U7.58)
VDAT4: FPGA (D9.87), CPLD (U7.64)
VDAT5: FPGA (D9.85), CPLD (U7.67)
VDAT6: FPGA (D9.75), CPLD (U7.69)
VDAT7: FPGA (D9.73), CPLD (U7.71)
VDAT8: FPGA (D9.71), CPLD (U7.72)
VDAT9: FPGA (D9.74), CPLD (U7.70)
VDAT10: FPGA (D9.83), CPLD (U7.68)
VDAT11: FPGA (D9.86), CPLD (U7.66)
VDAT12: FPGA (D9.88), CPLD (U7.61)
VDAT13: FPGA (D9.90), CPLD (U7.57)
VDAT14: FPGA (D9.93), CPLD (U7.55)
VDAT15: FPGA (D9.95), CPLD (U7.53)
VG_A0: FPGA (D9.69), FDC (D10.1)
VG_A1: FPGA (D9.70), FDC (D10.2)
VG_CLK: FPGA (D9.56), FDC (D6.24)
VG_DRQ: FPGA (D9.63), FDC (D6.38 R61.1)
VG_HRDY: FPGA (D9.55), FDC (D6.23 D7.13)
VG_IRQ: FPGA (D9.64), FDC (D6.39 R59.1)
VG_RAWR: FPGA (D9.58), FDC (D6.27)
VG_RCLK: FPGA (D9.57), FDC (D6.26)
VG_SIDE: FPGA (D9.65), FDC (D12.11)
VG_SL: FPGA (D9.47), FDC (D6.17)
VG_SR: FPGA (D9.53), FDC (D6.18)
VG_TR43: FPGA (D9.60), FDC (D6.29)
VG_WD: FPGA (D9.61), FDC (D6.31)
VG_WRD: FPGA (D9.67), FDC (D12.9)
VSYNC: FPGA (D9.112), CPLD (U7.50), Video out (R90.1)
~{WAIT}: FPGA (D9.143), CPU ROM (D1.21 R7.1), BUS (XS1.B21 XS2.B21)
~{WR}: FPGA (D9.140), CPU ROM (D1.19 R6.2), BUS (XS1.B19 XS2.B19), FDC (D6.2)
WRDAC: FPGA (D9.113), AY Amp (U1.13)